# EAGLE design transponder-6.1.0 (EAGLE 9.6.1)

## Sheet 1 of 7
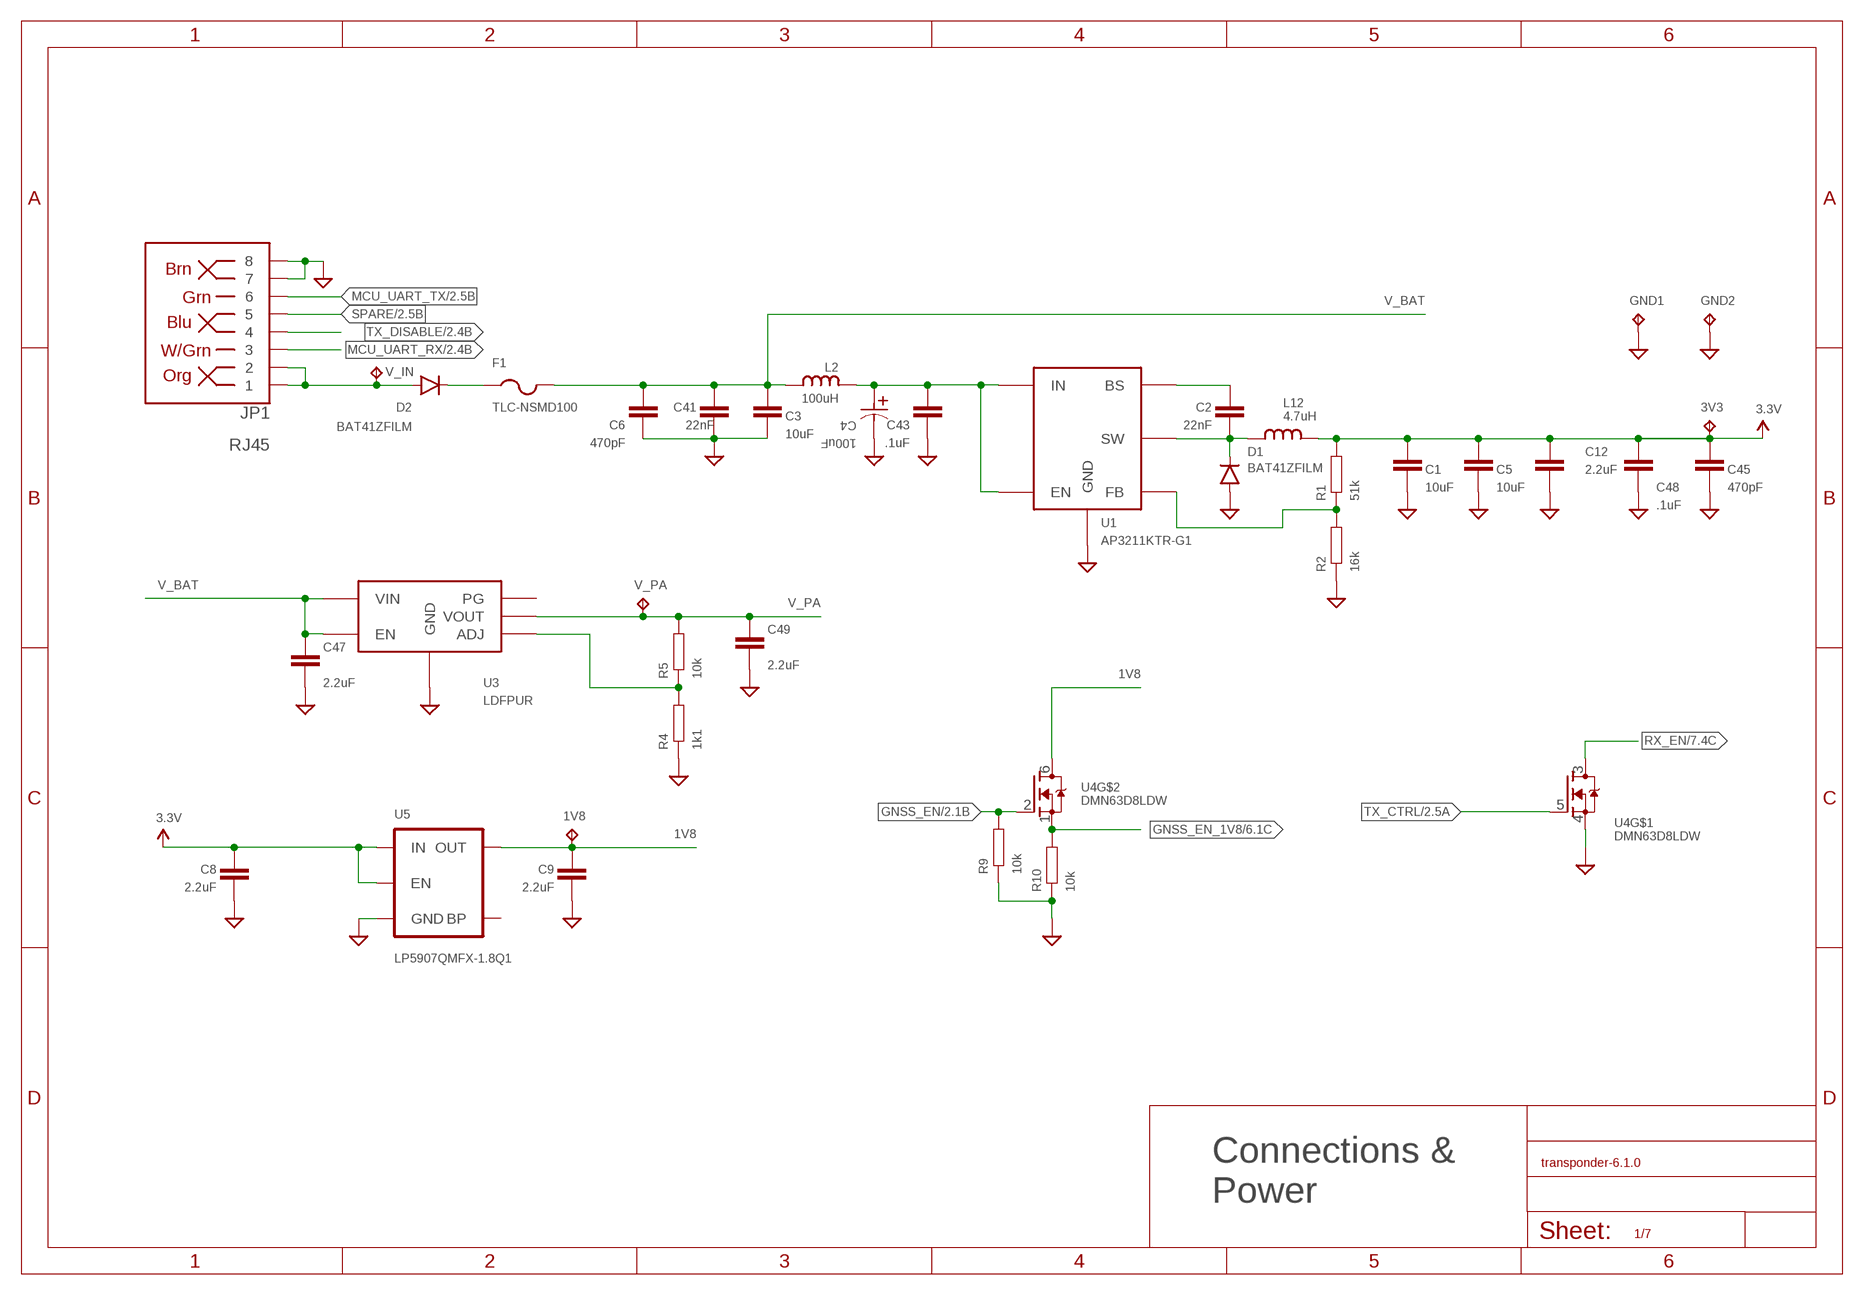
[diagram p0: schematic, sheet 1]

### Parts
1V8  TPTP12R  [TP12R]
3V3  TPTP16R  [TP16R]
C1  10uF  CAP0805  [0805]
C2  22nF  CAP0603-CAP  [0603-CAP]
C3  10uF  CAP0805  [0805]
C4  100uF  UWX1C101MCL1GB  [PCAP_6.3X5.4-ELECT]
C5  10uF  CAP0805  [0805]
C6  470pF  CAP0603-CAP  [0603-CAP]
C8  2.2uF  CAP0603-CAP  [0603-CAP]
C9  2.2uF  CAP0603-CAP  [0603-CAP]
C12  2.2uF  CAP0603-CAP  [0603-CAP]
C41  22nF  CAP0603-CAP  [0603-CAP]
C43  .1uF  CAP0603-CAP  [0603-CAP]
C45  470pF  CAP0603-CAP  [0603-CAP]
C47  2.2uF  CAP0603-CAP  [0603-CAP]
C48  .1uF  CAP0603-CAP  [0603-CAP]
C49  2.2uF  CAP0603-CAP  [0603-CAP]
D1  BAT41ZFILM  DIODESOD123  [SOD-123]
D2  BAT41ZFILM  DIODESOD123  [SOD-123]
F1  TLC-NSMD100  PTCFUSE-1206  [R1206]
GND1  TPTP16R  [TP16R]
GND2  TPTP16R  [TP16R]
JP1  RJ45  RJ45-8PTH  [RJ45-8]
L2  100uH  INDUCTOR1206  [1206]
L12  4.7uH  INDUCTOR0805  [0805]
R1  51k  RESISTOR0603-RES  [0603-RES]
R2  16k  RESISTOR0603-RES  [0603-RES]
R4  1k1  RESISTOR0603-RES  [0603-RES]
R5  10k  RESISTOR0603-RES  [0603-RES]
R9  10k  RESISTOR0603-RES  [0603-RES]
R10  10k  RESISTOR0603-RES  [0603-RES]
U1  AP3211KTR-G1  AP3211  [SOT23-6]
U3  LDFPUR  LDF  [DFN-6]
U4  DMN63D8LDW  [SOT363]
U5  LP5907QMFX-1.8Q1  V_REG_LDOSMD  [SOT23-5]
V_IN  TPTP12R  [TP12R]
V_PA  TPTP12R  [TP12R]

### Nets
1V8: 1V8.TP C9.1 U4.6(D) U5.5(OUT) ; also sheet 6,7
3.3V: 3V3.TP C1.1 C5.1 C8.1 C12.1 C45.1 C48.1 L12.P$2 R1.2 U5.1(IN) U5.3(EN) ; also sheet 2,4,6,7
GND: C1.2 C3.2 C4.2 C5.2 C6.2 C8.2 C9.2 C12.2 C41.2 C43.2 C45.2 C47.2 C48.2 C49.2 D1.A GND1.TP GND2.TP JP1.7 JP1.8 R2.1 R4.1 R9.1 R10.1 U1.2(GND) U3.P$4(GND) U3.P$7(GND) U4.4(S) U5.2(GND) ; also sheet 2,3,4,5,6,7
GNSS_EN: R9.2 U4.2(G) ; also sheet 2
GNSS_EN_1V8: R10.2 U4.1(S) ; also sheet 6
MCU_UART_RX: JP1.3 ; also sheet 2
MCU_UART_TX: JP1.6 ; also sheet 2
N$2: C2.2 D1.C L12.P$1 U1.6(SW)
N$4: C2.1 U1.1(BS)
N$5: R1.1 R2.2 U1.3(FB)
N$22: D2.C F1.1
N$27: C4.1 C43.1 L2.P$1 U1.4(EN) U1.5(IN)
N$32: R4.2 R5.1 U3.P$2(ADJ)
RX_EN: U4.3(D) ; also sheet 7
SPARE: JP1.5 ; also sheet 2
TX_CTRL: U4.5(G) ; also sheet 2,5
TX_DISABLE: JP1.4 ; also sheet 2
V_BAT: C3.1 C6.1 C41.1 C47.1 F1.2 L2.P$2 U3.P$5(EN) U3.P$6(VIN)
V_IN: D2.A JP1.1 JP1.2 V_IN.TP
V_PA: C49.1 R5.2 U3.P$1(VOUT) V_PA.TP ; also sheet 5
Unconnected: U3.P$3(PG) U5.4(BP)

### Notes on the sheet
- Connections &
  Power

## Sheet 2 of 7
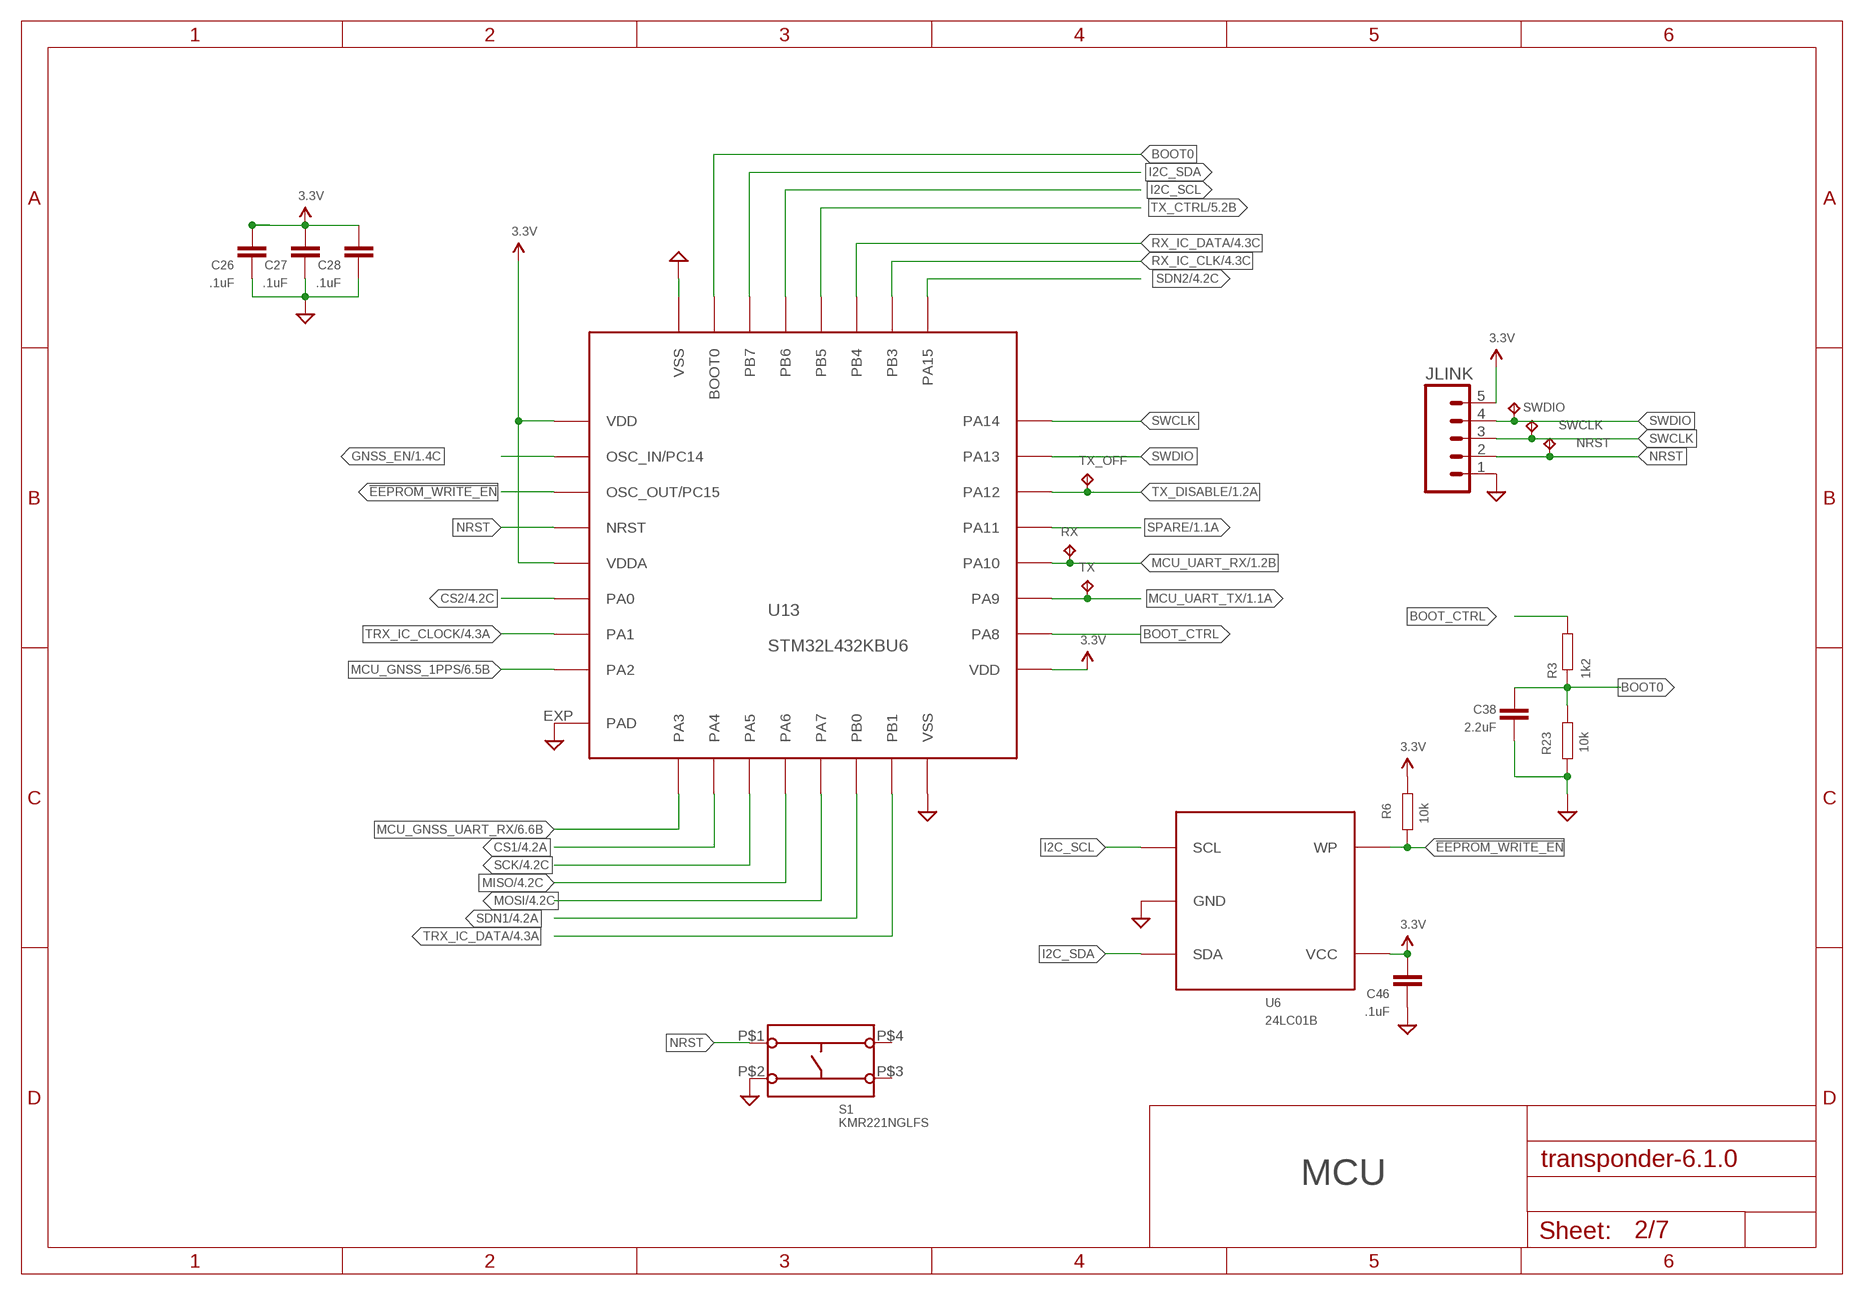
[diagram p1: schematic, sheet 2]

### Parts
C26  .1uF  CAP0603-CAP  [0603-CAP]
C27  .1uF  CAP0603-CAP  [0603-CAP]
C28  .1uF  CAP0603-CAP  [0603-CAP]
C38  2.2uF  CAP0603-CAP  [0603-CAP]
C46  .1uF  CAP0603-CAP  [0603-CAP]
JLINK  M05PTH  [1X05]
NRST  TPTP12R  [TP12R]
R3  1k2  RESISTOR0603-RES  [0603-RES]
R6  10k  RESISTOR0603-RES  [0603-RES]
R23  10k  RESISTOR0603-RES  [0603-RES]
RX  TPTP12R  [TP12R]
S1  KMR221NGLFS  [KMR221NGLFS]
SWCLK  TPTP12R  [TP12R]
SWDIO  TPTP12R  [TP12R]
TX  TPTP12R  [TP12R]
TX_OFF  TPTP12R  [TP12R]
U6  24LC01B  [SOT23-5]
U13  STM32L432KBU6  STM32L432KXXX  [QFN32]

### Nets
3.3V: C26.1 C27.1 C28.1 C46.1 JLINK.5 R6.1 U6.4(VCC) U13.1(VDD) U13.5(VDDA) U13.17(VDD) ; also sheet 1,4,6,7
!EEPROM_WRITE_EN: R6.2 U6.5(WP) U13.3(OSC_OUT/PC15)
BOOT0: C38.1 R3.1 R23.1 U13.31(BOOT0)
BOOT_CTRL: R3.2 U13.18(PA8)
CS1: U13.10(PA4) ; also sheet 4
CS2: U13.6(PA0) ; also sheet 4
GND: C26.2 C27.2 C28.2 C38.2 C46.2 JLINK.1 R23.2 S1.P$2(S2) U6.2(GND) U13.16(VSS) U13.32(VSS) U13.EXP(PAD) ; also sheet 1,3,4,5,6,7
GNSS_EN: U13.2(OSC_IN/PC14) ; also sheet 1
I2C_SCL: U6.1(SCL) U13.29(PB6)
I2C_SDA: U6.3(SDA) U13.30(PB7)
MCU_GNSS_1PPS: U13.8(PA2) ; also sheet 6
MCU_GNSS_UART_RX: U13.9(PA3) ; also sheet 6
MCU_UART_RX: RX.TP U13.20(PA10) ; also sheet 1
MCU_UART_TX: TX.TP U13.19(PA9) ; also sheet 1
MISO: U13.12(PA6) ; also sheet 4
MOSI: U13.13(PA7) ; also sheet 4
NRST: JLINK.2 NRST.TP S1.P$1(S1) U13.4(NRST)
RX_IC_CLK: U13.26(PB3) ; also sheet 4
RX_IC_DATA: U13.27(PB4) ; also sheet 4
SCK: U13.11(PA5) ; also sheet 4
SDN1: U13.14(PB0) ; also sheet 4
SDN2: U13.25(PA15) ; also sheet 4
SPARE: U13.21(PA11) ; also sheet 1
SWCLK: JLINK.3 SWCLK.TP U13.24(PA14)
SWDIO: JLINK.4 SWDIO.TP U13.23(PA13)
TRX_IC_CLOCK: U13.7(PA1) ; also sheet 4
TRX_IC_DATA: U13.15(PB1) ; also sheet 4
TX_CTRL: U13.28(PB5) ; also sheet 1,5
TX_DISABLE: TX_OFF.TP U13.22(PA12) ; also sheet 1
Unconnected: S1.P$3(S2) S1.P$4(S1)

### Notes on the sheet
- MCU

## Sheet 3 of 7
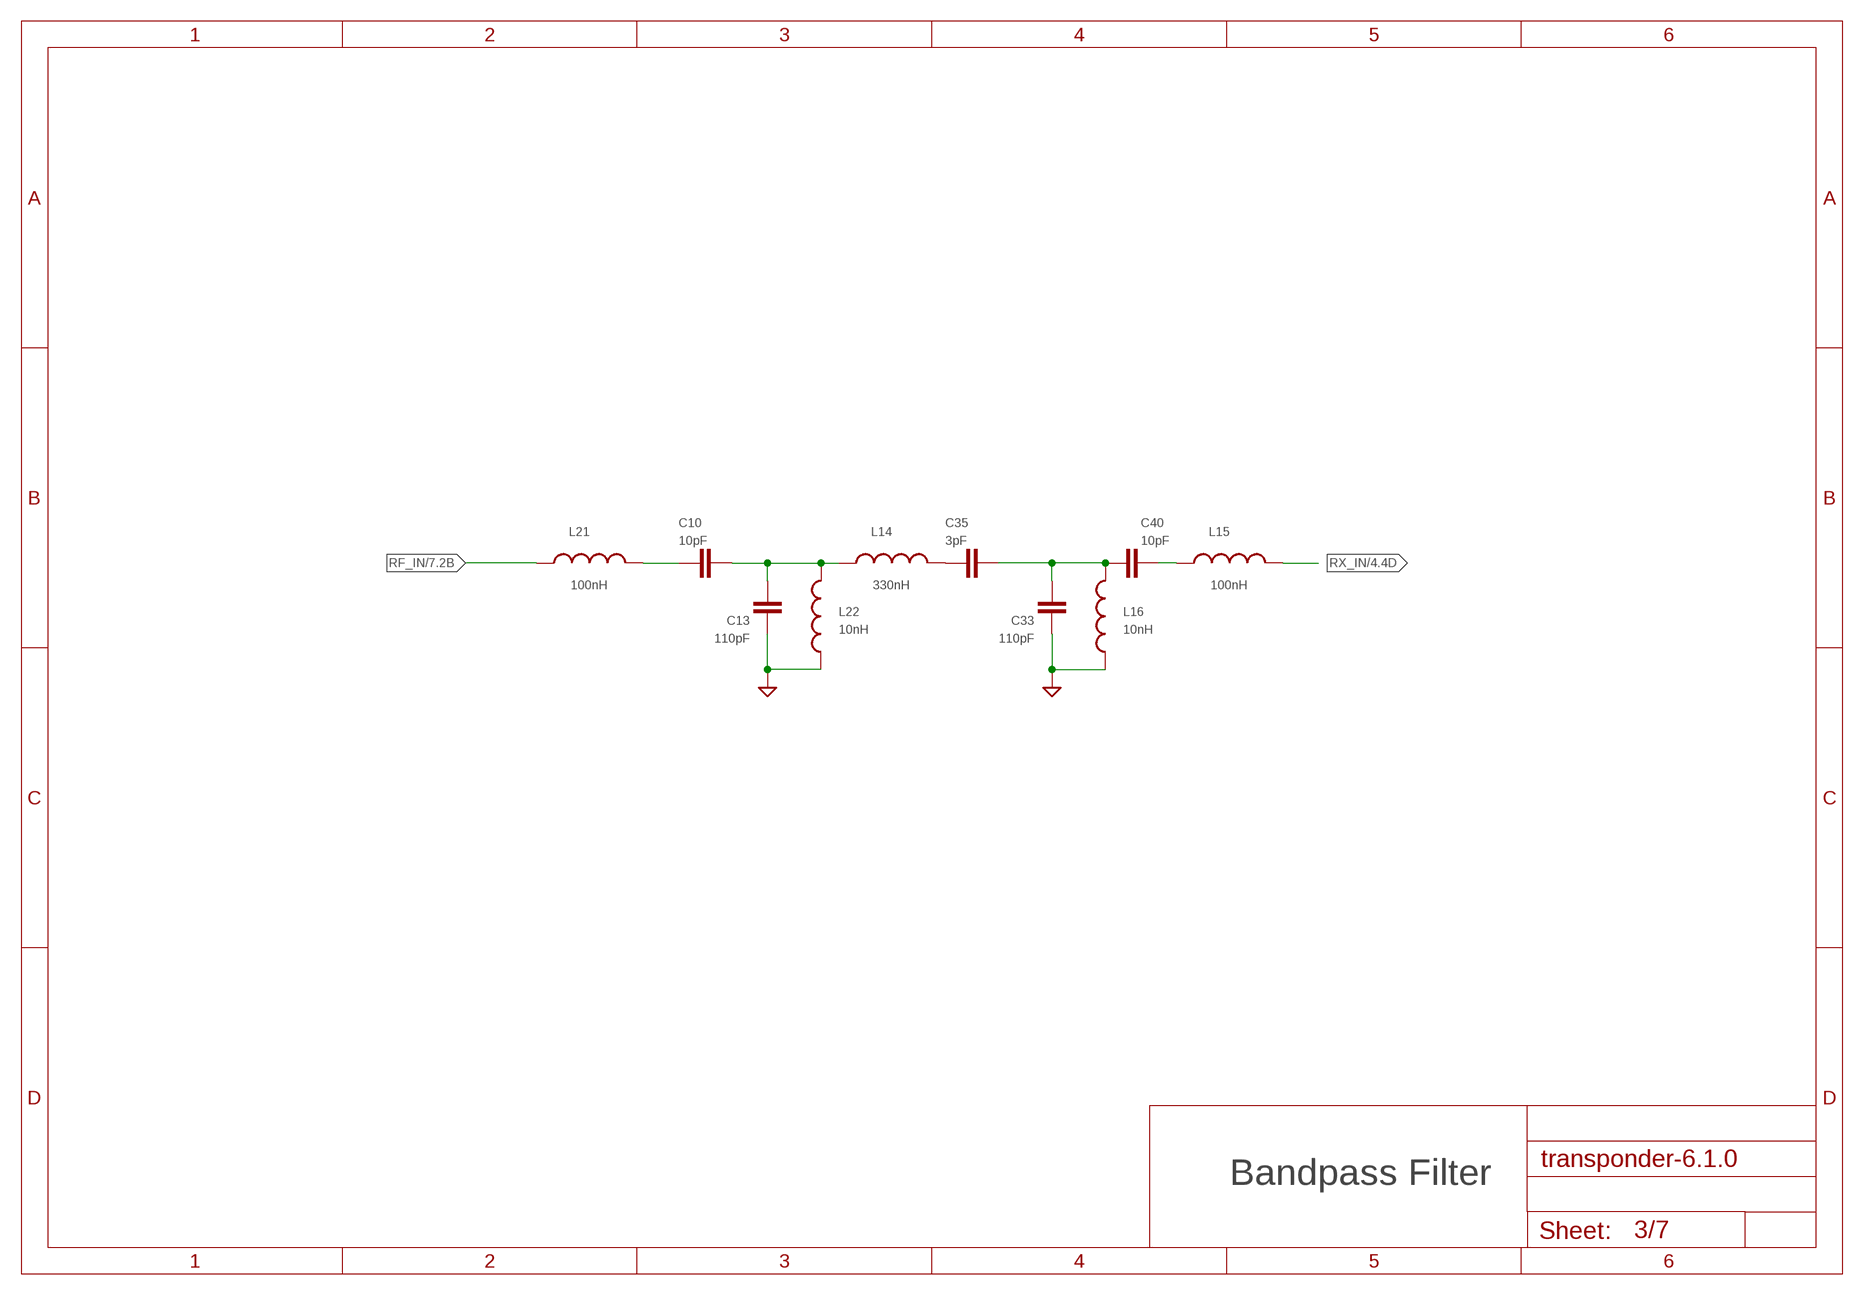
[diagram p2: schematic, sheet 3]

### Parts
C10  10pF  CAP0603-CAP  [0603-CAP]
C13  110pF  CAP0603-CAP  [0603-CAP]
C33  110pF  CAP0603-CAP  [0603-CAP]
C35  3pF  CAP0603-CAP  [0603-CAP]
C40  10pF  CAP0603-CAP  [0603-CAP]
L14  330nH  INDUCTOR0603  [0603]
L15  100nH  INDUCTOR0603  [0603]
L16  10nH  INDUCTOR0603  [0603]
L21  100nH  INDUCTOR0603  [0603]
L22  10nH  INDUCTOR0603  [0603]

### Nets
GND: C13.1 C33.1 L16.1 L22.1 ; also sheet 1,2,4,5,6,7
N$9: C10.2 L21.2
N$36: C10.1 C13.2 L14.1 L22.2
N$37: C33.2 C35.1 C40.2 L16.2
N$38: C40.1 L15.1
N$39: C35.2 L14.2
RF_IN: L21.1 ; also sheet 7
RX_IN: L15.2 ; also sheet 4

### Notes on the sheet
- Bandpass Filter

## Sheet 4 of 7
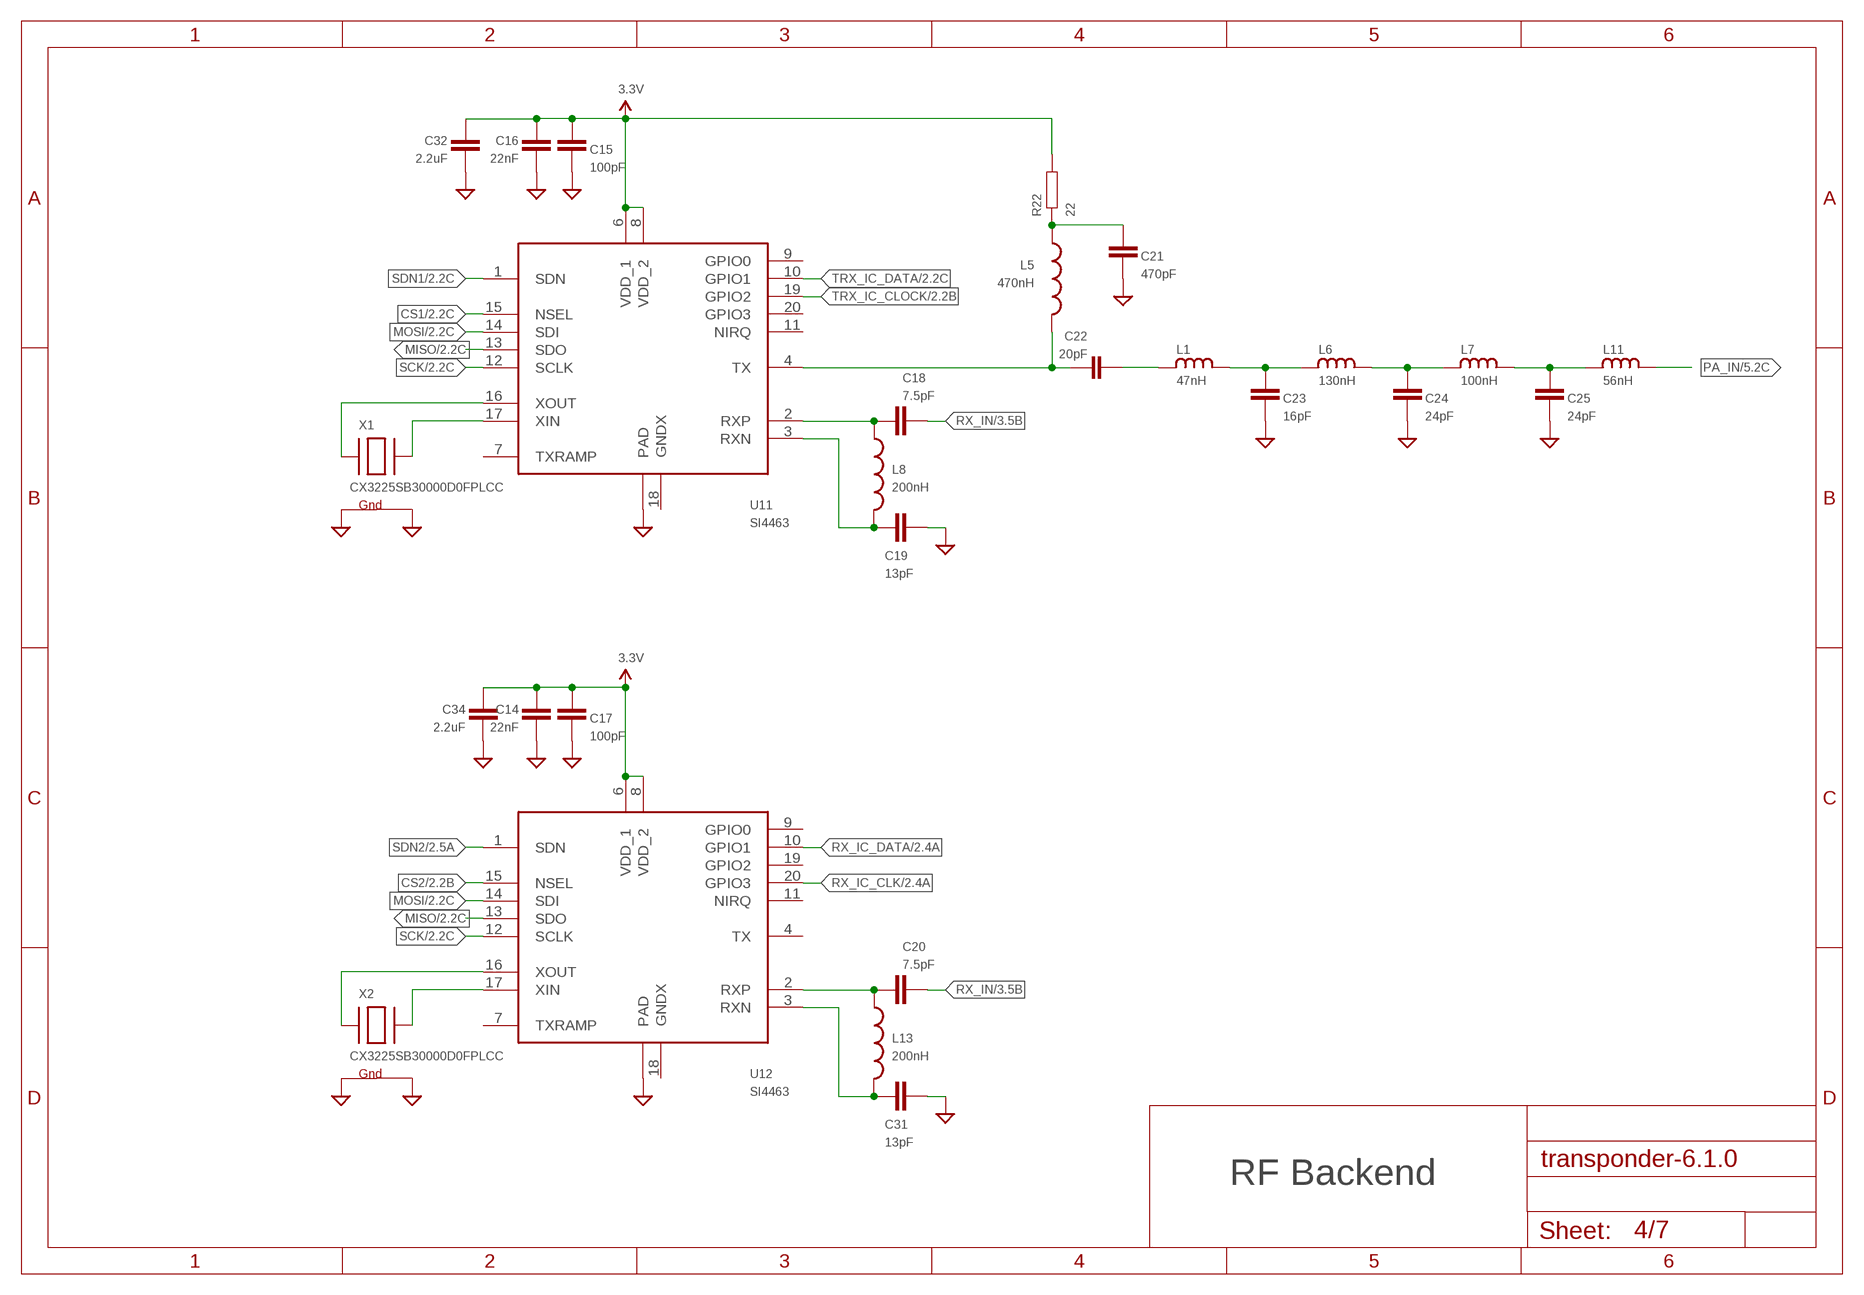
[diagram p3: schematic, sheet 4]

### Parts
C14  22nF  CAP0603-CAP  [0603-CAP]
C15  100pF  CAP0603-CAP  [0603-CAP]
C16  22nF  CAP0603-CAP  [0603-CAP]
C17  100pF  CAP0603-CAP  [0603-CAP]
C18  7.5pF  CAP0603-CAP  [0603-CAP]
C19  13pF  CAP0603-CAP  [0603-CAP]
C20  7.5pF  CAP0603-CAP  [0603-CAP]
C21  470pF  CAP0603-CAP  [0603-CAP]
C22  20pF  CAPACITOR0603  [0603]
C23  16pF  CAP0603-CAP  [0603-CAP]
C24  24pF  CAP0603-CAP  [0603-CAP]
C25  24pF  CAP0603-CAP  [0603-CAP]
C31  13pF  CAP0603-CAP  [0603-CAP]
C32  2.2uF  CAP0603-CAP  [0603-CAP]
C34  2.2uF  CAP0603-CAP  [0603-CAP]
L1  47nH  INDUCTOR0603  [0603]
L5  470nH  INDUCTOR0603  [0603]
L6  130nH  INDUCTOR0603  [0603]
L7  100nH  INDUCTOR0603  [0603]
L8  200nH  INDUCTOR0603  [0603]
L11  56nH  INDUCTOR0603  [0603]
L13  200nH  INDUCTOR0603  [0603]
R22  22  RESISTOR0603-RES  [0603-RES]
U11  SI4463  [SI4463]
U12  SI4463  [SI4463]
X1  CX3225SB30000D0FPLCC  XTAL-4-3225  [NX3225]
X2  CX3225SB30000D0FPLCC  XTAL-4-3225  [NX3225]

### Nets
3.3V: C14.1 C15.1 C16.1 C17.1 C32.1 C34.1 R22.2 U11.6(VDD_1) U11.8(VDD_2) U12.6(VDD_1) U12.8(VDD_2) ; also sheet 1,2,6,7
CS1: U11.15(NSEL) ; also sheet 2
CS2: U12.15(NSEL) ; also sheet 2
GND: C14.2 C15.2 C16.2 C17.2 C19.1 C21.2 C23.2 C24.2 C25.2 C31.1 C32.2 C34.2 U11.EXP(PAD) U12.EXP(PAD) X1.2(G2) X1.4(G1) X2.2(G2) X2.4(G1) ; also sheet 1,2,3,5,6,7
MISO: U11.13(SDO) U12.13(SDO) ; also sheet 2
MOSI: U11.14(SDI) U12.14(SDI) ; also sheet 2
N$3: C19.2 L8.2 U11.3(RXN)
N$6: C18.1 L8.1 U11.2(RXP)
N$7: C24.1 L6.P$2 L7.P$1
N$11: C25.1 L7.P$2 L11.P$1
N$12: C23.1 L1.P$2 L6.P$1
N$16: U12.16(XOUT) X2.1(X1)
N$17: U12.17(XIN) X2.3(X2)
N$18: U11.16(XOUT) X1.1(X1)
N$19: U11.17(XIN) X1.3(X2)
N$20: C20.1 L13.1 U12.2(RXP)
N$21: C31.2 L13.2 U12.3(RXN)
N$24: C22.P$1 L5.2 U11.4(TX)
N$30: C21.1 L5.1 R22.1
N$31: C22.P$2 L1.P$1
PA_IN: L11.P$2 ; also sheet 5
RX_IC_CLK: U12.20(GPIO3) ; also sheet 2
RX_IC_DATA: U12.10(GPIO1) ; also sheet 2
RX_IN: C18.2 C20.2 ; also sheet 3
SCK: U11.12(SCLK) U12.12(SCLK) ; also sheet 2
SDN1: U11.1(SDN) ; also sheet 2
SDN2: U12.1(SDN) ; also sheet 2
TRX_IC_CLOCK: U11.19(GPIO2) ; also sheet 2
TRX_IC_DATA: U11.10(GPIO1) ; also sheet 2
Unconnected: U11.7(TXRAMP) U11.9(GPIO0) U11.11(NIRQ) U11.18(GNDX) U11.20(GPIO3) U12.4(TX) U12.7(TXRAMP) U12.9(GPIO0) U12.11(NIRQ) U12.18(GNDX) U12.19(GPIO2)

### Notes on the sheet
- RF Backend

## Sheet 5 of 7
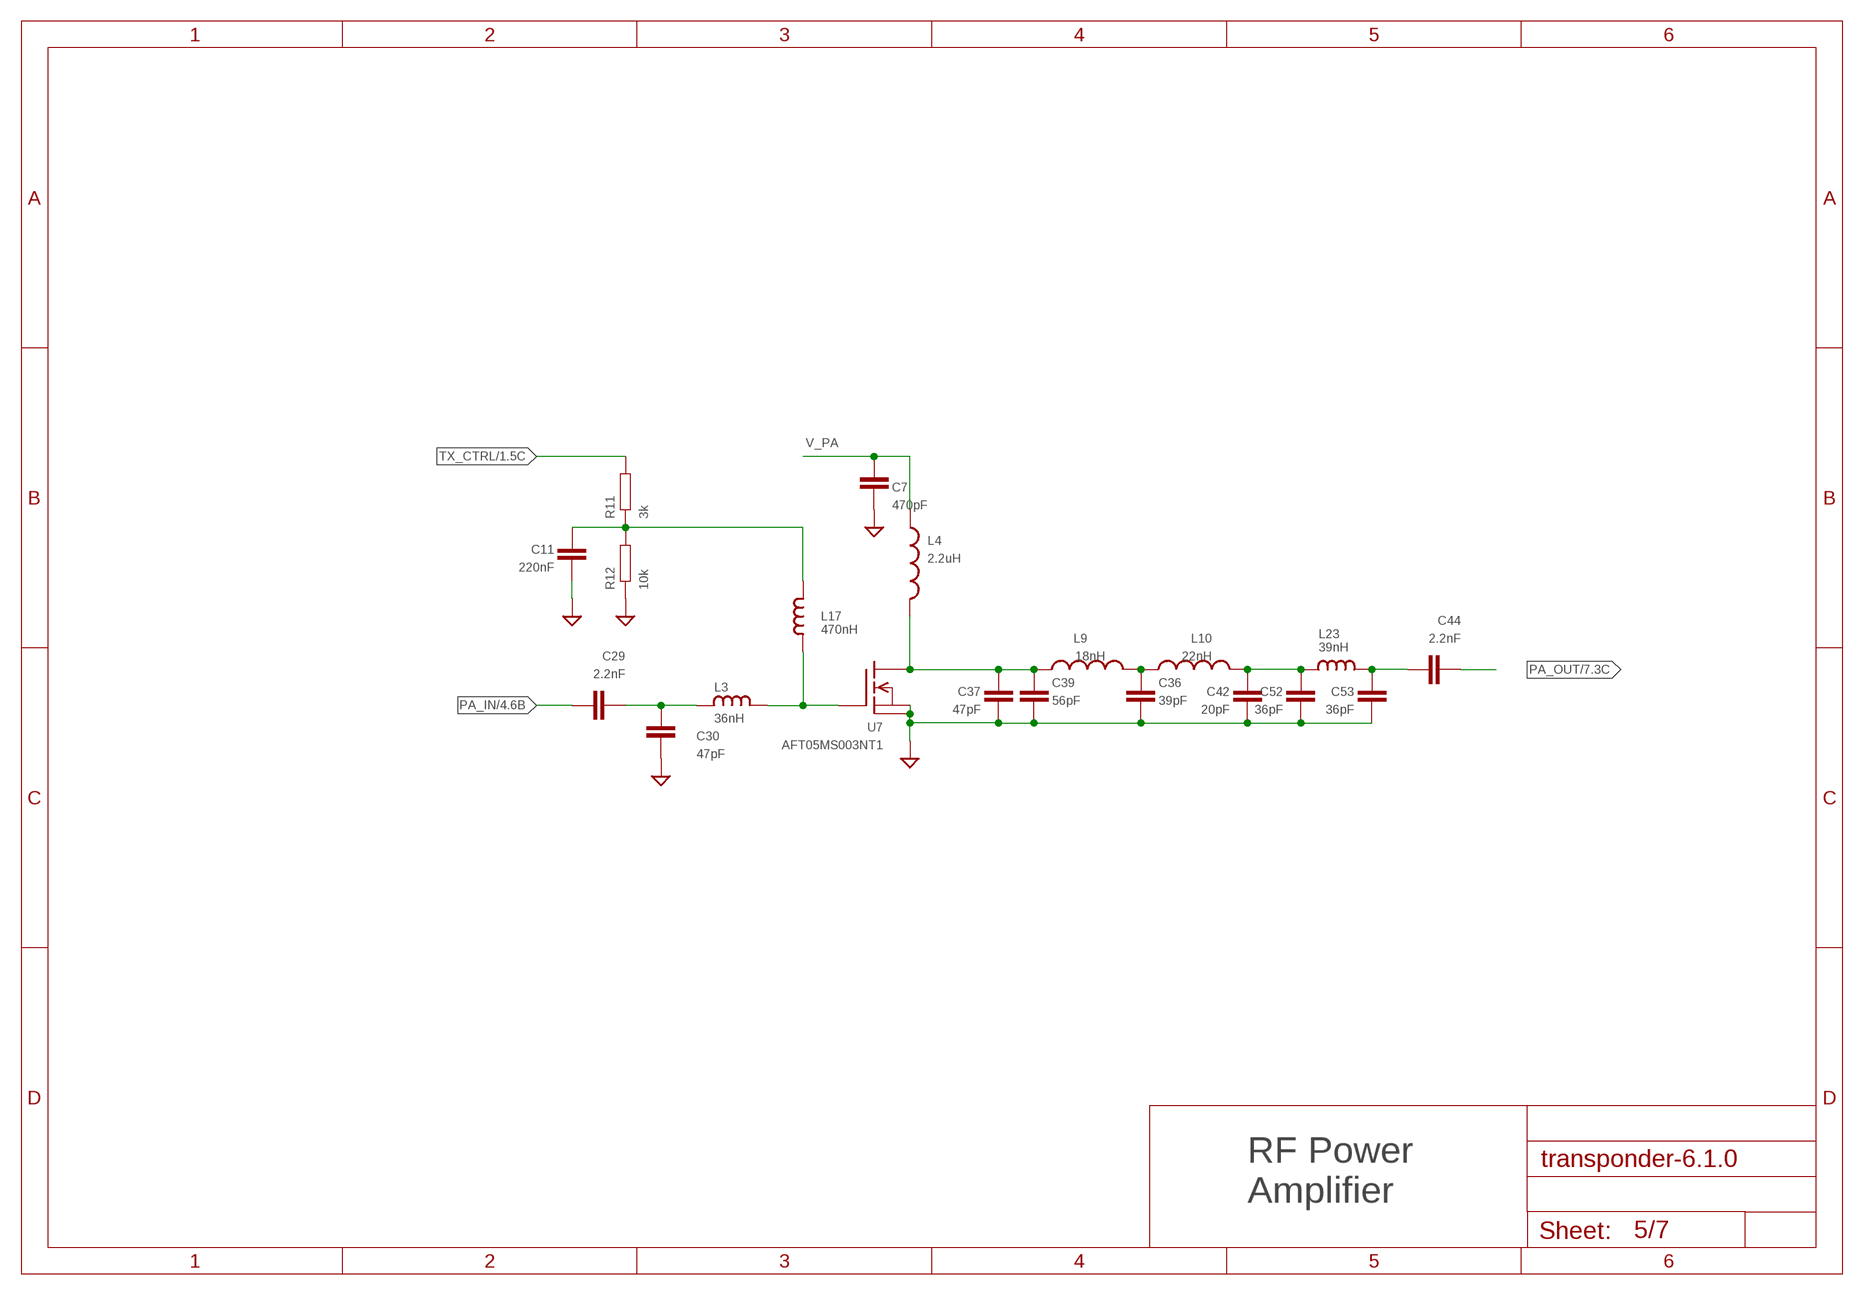
[diagram p4: schematic, sheet 5]

### Parts
C7  470pF  CAP0603-CAP  [0603-CAP]
C11  220nF  CAP0603-CAP  [0603-CAP]
C29  2.2nF  CAP0603-CAP  [0603-CAP]
C30  47pF  CAP0603-CAP  [0603-CAP]
C36  39pF  CAP0603-CAP  [0603-CAP]
C37  47pF  CAP0603-CAP  [0603-CAP]
C39  56pF  CAP0603-CAP  [0603-CAP]
C42  20pF  CAP0603-CAP  [0603-CAP]
C44  2.2nF  CAP0603-CAP  [0603-CAP]
C52  36pF  CAP0603-CAP  [0603-CAP]
C53  36pF  CAP0603-CAP  [0603-CAP]
L3  36nH  INDUCTOR0603  [0603]
L4  2.2uH  INDUCTOR0805  [0805]
L9  18nH  INDUCTOR0603  [0603]
L10  22nH  INDUCTOR0603  [0603]
L17  470nH  INDUCTOR0603  [0603]
L23  39nH  INDUCTOR0603  [0603]
R11  3k  RESISTOR0603-RES  [0603-RES]
R12  10k  RESISTOR0603-RES  [0603-RES]
U7  AFT05MS003NT1  AFT0SMS003N  [SOT-89]

### Nets
GND: C7.2 C11.2 C30.2 C36.2 C37.2 C39.2 C42.2 C52.2 C53.2 R12.1 U7.2(S) U7.2@1(PAD) ; also sheet 1,2,3,4,6,7
N$8: C11.1 L17.P$2 R11.1 R12.2
N$23: C37.1 C39.1 L4.2 L9.1 U7.3(D)
N$26: L3.P$2 L17.P$1 U7.1(G)
N$28: C36.1 L9.2 L10.1
N$29: C29.2 C30.1 L3.P$1
N$40: C42.1 C52.1 L10.2 L23.P$1
N$41: C44.1 C53.1 L23.P$2
PA_IN: C29.1 ; also sheet 4
PA_OUT: C44.2 ; also sheet 7
TX_CTRL: R11.2 ; also sheet 1,2
V_PA: C7.1 L4.1 ; also sheet 1

### Notes on the sheet
- RF Power
  Amplifier

## Sheet 6 of 7
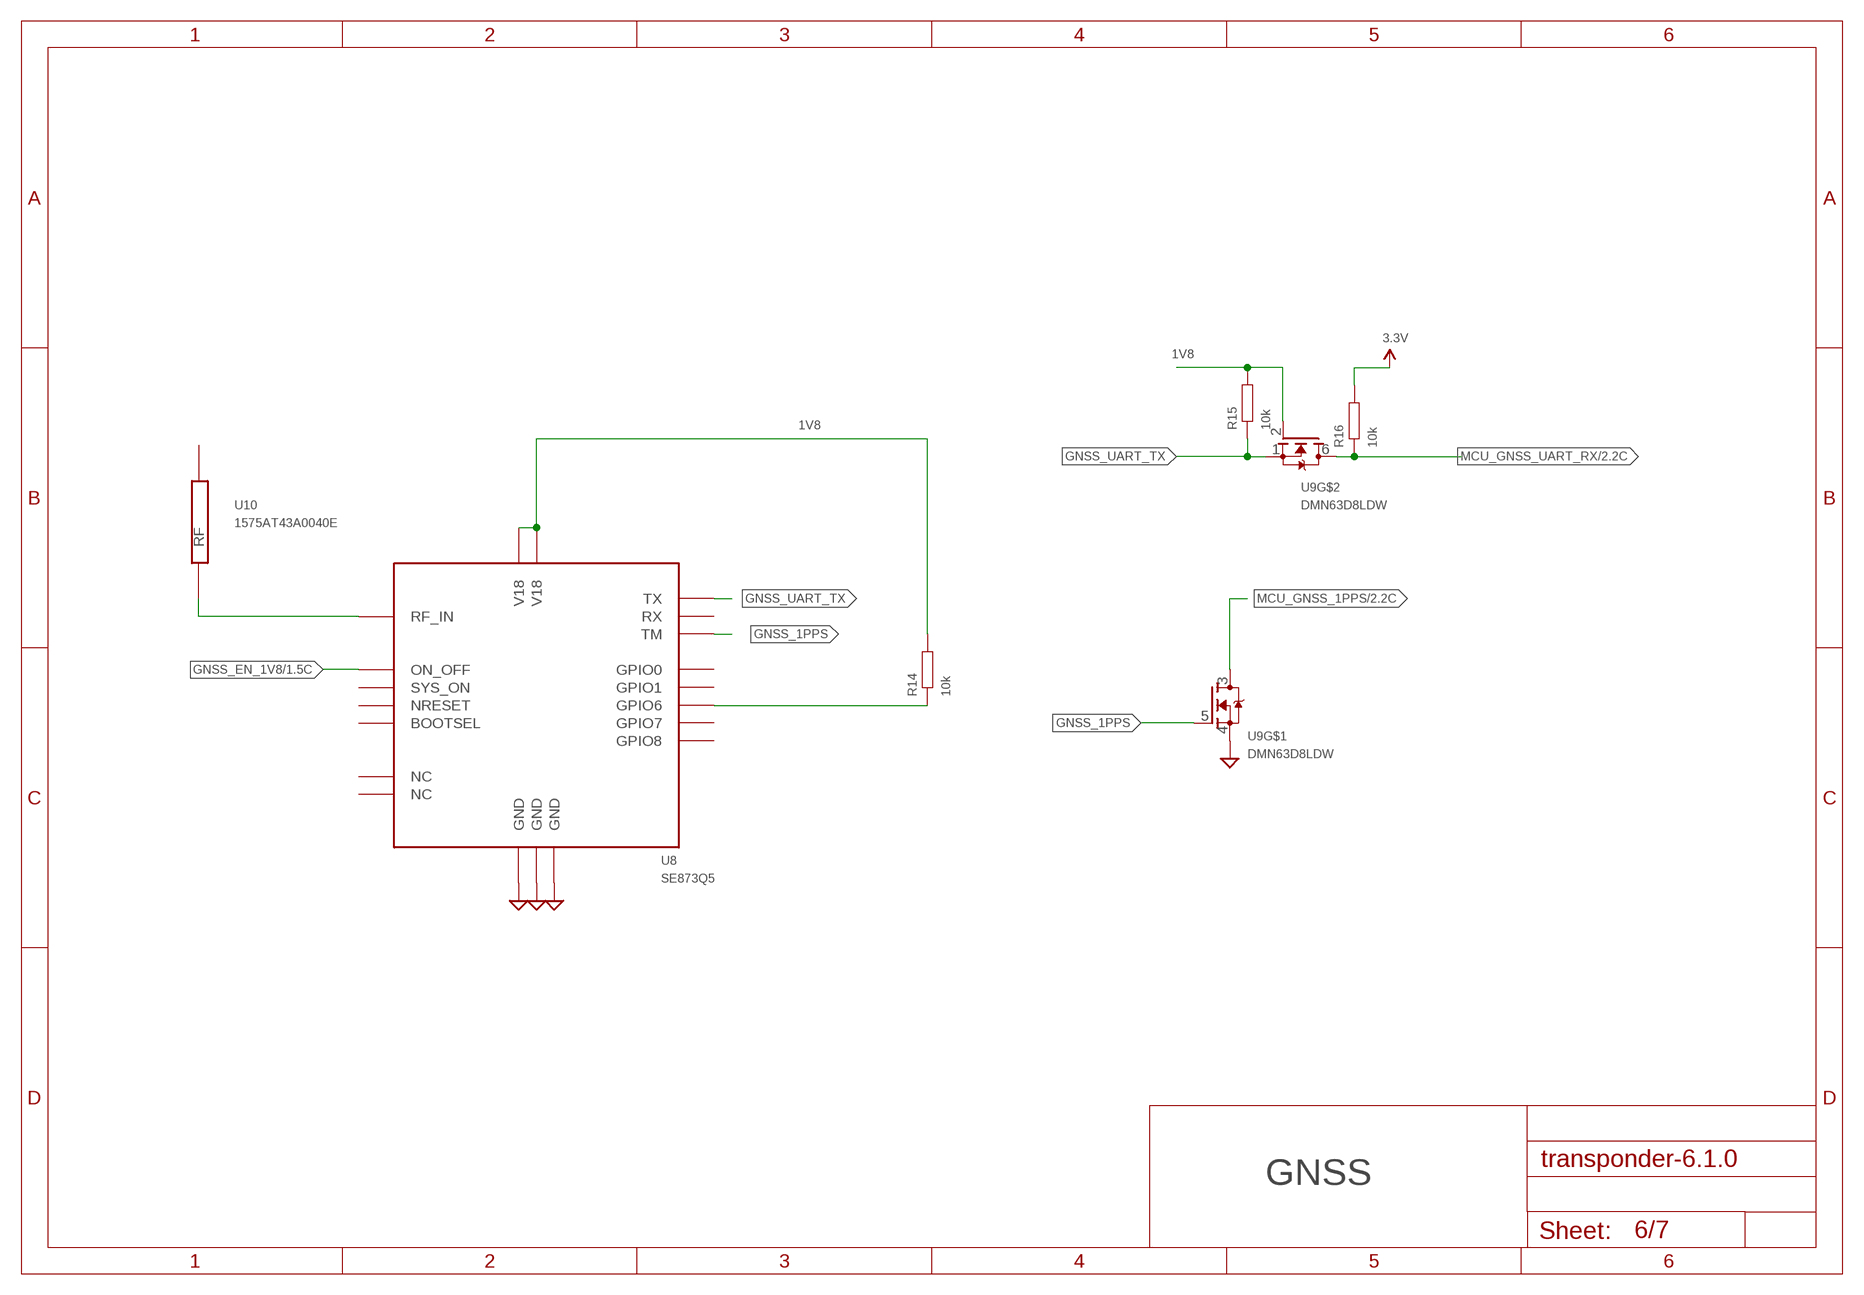
[diagram p5: schematic, sheet 6]

### Parts
R14  10k  RESISTOR0603-RES  [0603-RES]
R15  10k  RESISTOR0603-RES  [0603-RES]
R16  10k  RESISTOR0603-RES  [0603-RES]
U8  SE873Q5  SE873  [SE873]
U9  DMN63D8LDW  [SOT363]
U10  1575AT43A0040E  [1575AT43A0040E]

### Nets
1V8: R14.2 R15.2 U8.P$3(V18) U8.P$19(V18) U9.2(G) ; also sheet 1,7
3.3V: R16.2 ; also sheet 1,2,4,7
GND: U8.P$2(GND) U8.P$10(GND) U8.P$20(GND) U9.4(S) ; also sheet 1,2,3,4,5,7
GNSS_1PPS: U8.P$11(TM) U9.5(G)
GNSS_EN_1V8: U8.P$6(ON_OFF) ; also sheet 1
GNSS_UART_TX: R15.1 U8.P$15(TX) U9.1(S)
MCU_GNSS_1PPS: U9.3(D) ; also sheet 2
MCU_GNSS_UART_RX: R16.1 U9.6(D) ; also sheet 2
N$10: U8.P$1(RF_IN) U10.P$1(RF)
N$13: R14.1 U8.P$13(GPIO6)
Unconnected: U8.P$4(NC) U8.P$5(GPIO8) U8.P$7(SYS_ON) U8.P$8(NRESET) U8.P$9(BOOTSEL) U8.P$12(GPIO7) U8.P$14(RX) U8.P$16(NC) U8.P$17(GPIO1) U8.P$18(GPIO0) U10.P$2(PAD)

### Notes on the sheet
- GNSS

## Sheet 7 of 7
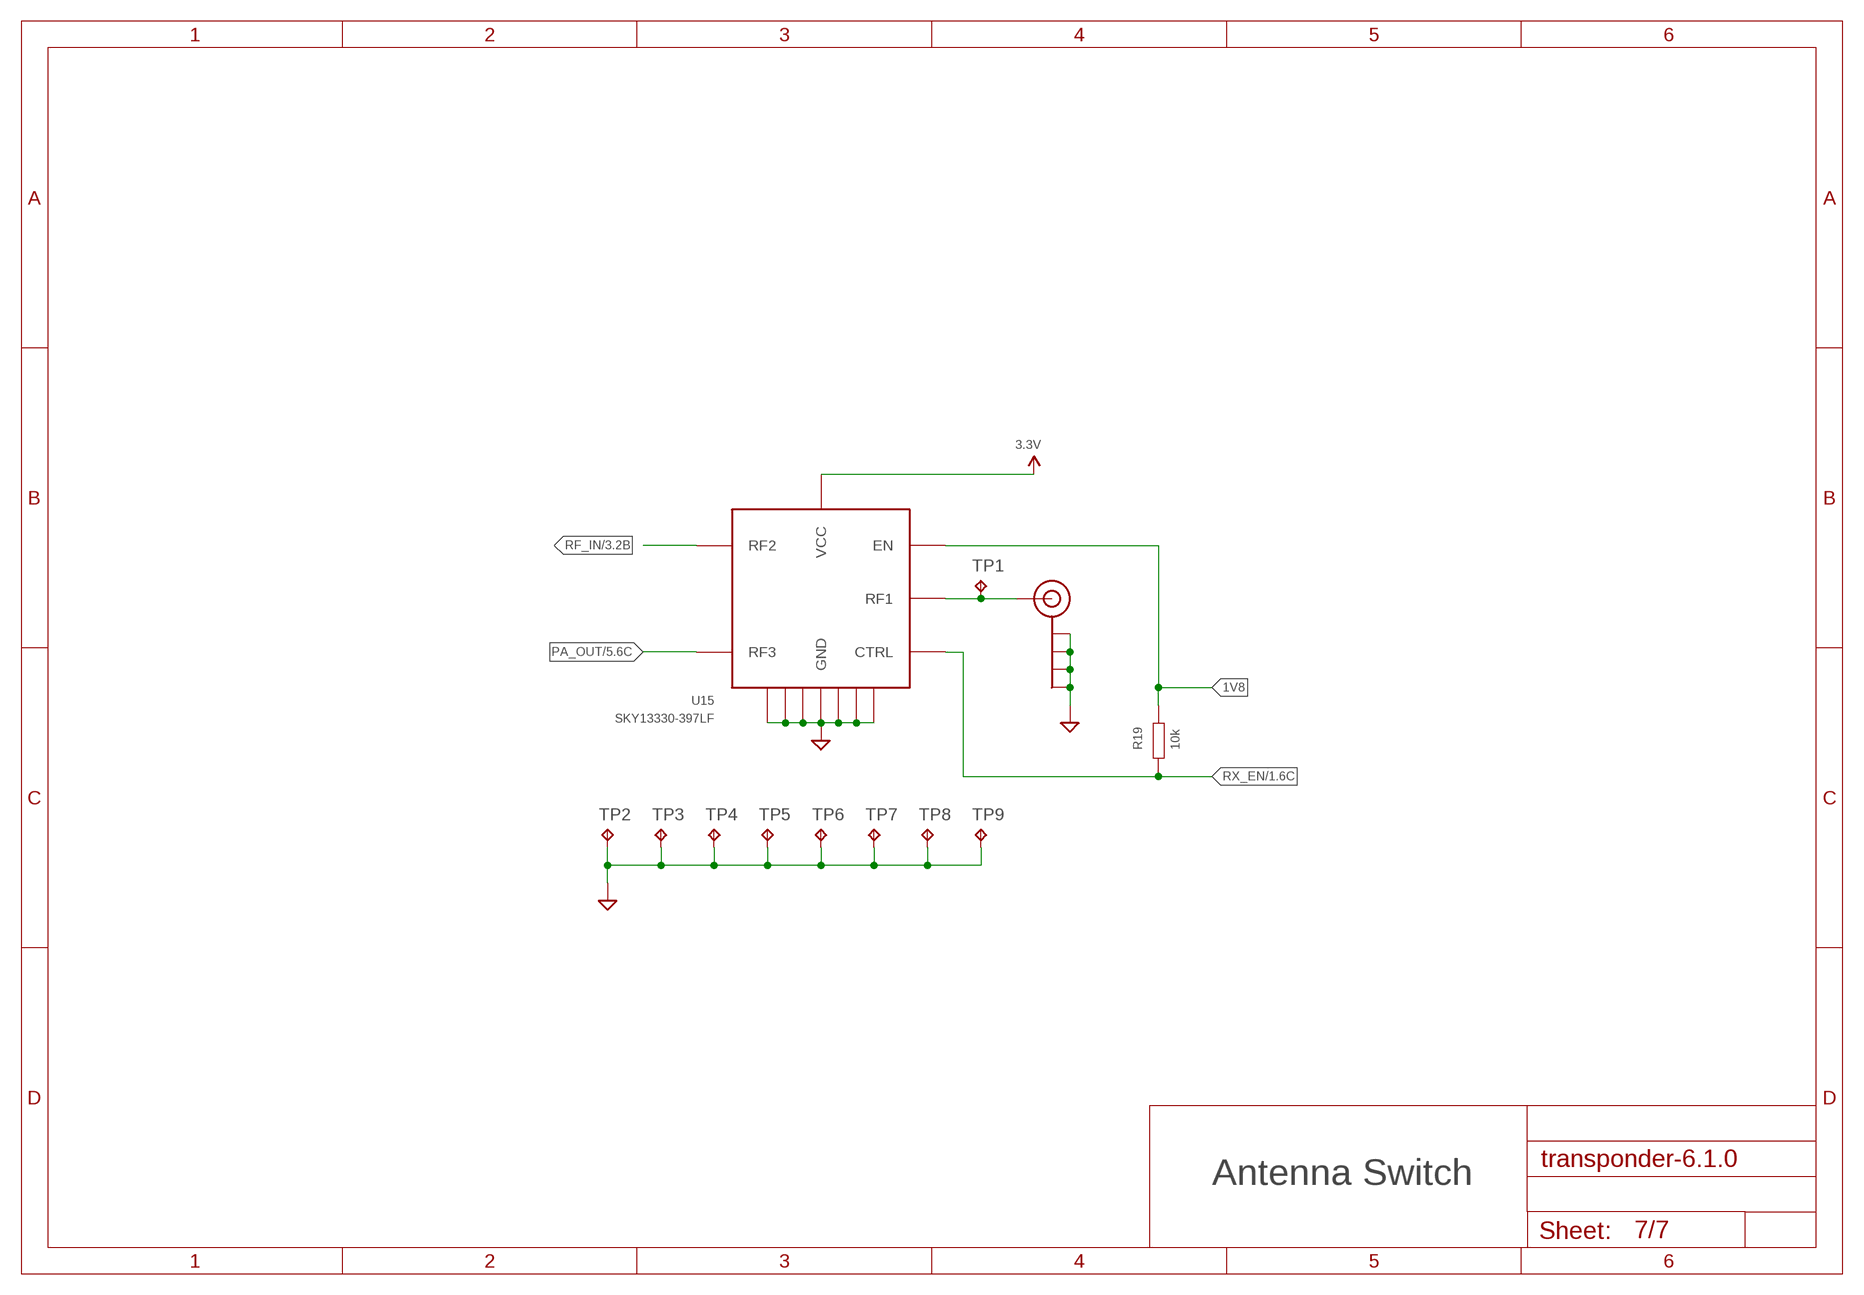
[diagram p6: schematic, sheet 7]

### Parts
J$1  SMA_EDGE  [SMA-EDGE]
R19  10k  RESISTOR0603-RES  [0603-RES]
TP1  TPTP10R  [TP10R]
TP2  TPTP08R  [TP08R]
TP3  TPTP08R  [TP08R]
TP4  TPTP08R  [TP08R]
TP5  TPTP08R  [TP08R]
TP6  TPTP08R  [TP08R]
TP7  TPTP08R  [TP08R]
TP8  TPTP08R  [TP08R]
TP9  TPTP08R  [TP08R]
U15  SKY13330-397LF  SKYWORKS-13330397LF  [QFN12]

### Nets
1V8: R19.2 U15.P$8(EN) ; also sheet 1,6
3.3V: U15.P$9(VCC) ; also sheet 1,2,4,6
GND: J$1.GND@0(GND) J$1.GND@1(GND) J$1.GND@2(GND) J$1.GND@3(GND) TP2.TP TP3.TP TP4.TP TP5.TP TP6.TP TP7.TP TP8.TP TP9.TP U15.P$1(GND) U15.P$3(GND) U15.P$4(GND) U15.P$6(GND) U15.P$10(GND) U15.P$12(GND) U15.P$13(GND) ; also sheet 1,2,3,4,5,6
N$15: J$1.SIG(SIGNAL) TP1.TP U15.P$2(RF1)
PA_OUT: U15.P$5(RF3) ; also sheet 5
RF_IN: U15.P$11(RF2) ; also sheet 3
RX_EN: R19.1 U15.P$7(CTRL) ; also sheet 1

### Notes on the sheet
- Antenna Switch

## Library data of the parts
1V8 3V3 GND1 GND2 NRST RX SWCLK SWDIO TX TX_OFF V_IN V_PA = testpad:TP: Test pad; DNP: T
C1 C3 C5 = SparkFun-Capacitors:CAP: Capacitor Standard 0603 ceramic capacitor, and 0.1" leaded capacitor.; PARTNO: EMK212ABJ106KG-T
C2 C14 C16 C41 = SparkFun-Capacitors:CAP: Capacitor Standard 0603 ceramic capacitor, and 0.1" leaded capacitor.; PARTNO: GRM188R71E223KA01D
C4 = UWX1C101MCL1GB:UWX1C101MCL1GB: 100µF 16V Aluminum Electrolytic Capacitors Radial, Can - SMD 2000 Hrs @ 85°C Check prices <https://snapeda.com/parts/UWX1C101MCL1GB/Nichicon/view-part/?ref=eda>; ARROW_ELECTRONICS-PURCHASE-URL: https://snapeda.com/shop?store=Arrow+Electronics&id=624199; AVAILABILITY: Good; DESCRIPTION: 100µF 16V Aluminum Electrolytic Capacitors Radial, Can - SMD 2000 Hrs @ 85°C; DIGIKEY-PURCHASE-URL: https://snapeda.com/shop?store=DigiKey&id=624199; MF: Nichicon; MOUSER-PURCHASE-URL: https://snapeda.com/shop?store=Mouser&id=624199; MP: UWX1C101MCL1GB; PACKAGE: Radial Nichicon; PARTNO: UWX1C101MCL1GB; PRICE: None
C6 C7 C21 C45 = SparkFun-Capacitors:CAP: Capacitor Standard 0603 ceramic capacitor, and 0.1" leaded capacitor.; PARTNO: GCM1885C2A471JA16J
C8 C9 C12 C32 C34 C38 C47 C49 = SparkFun-Capacitors:CAP: Capacitor Standard 0603 ceramic capacitor, and 0.1" leaded capacitor.; PARTNO: EMK107BJ225KA-T
C10 C11 C13 C33 C35 C40 C52 C53 = SparkFun-Capacitors:CAP: Capacitor Standard 0603 ceramic capacitor, and 0.1" leaded capacitor.
C15 C17 = SparkFun-Capacitors:CAP: Capacitor Standard 0603 ceramic capacitor, and 0.1" leaded capacitor.; PARTNO: GCM1885C2A101JA16D
C18 C20 = SparkFun-Capacitors:CAP: Capacitor Standard 0603 ceramic capacitor, and 0.1" leaded capacitor.; PARTNO: GRM1885C1H7R5DA01D
C19 C31 = SparkFun-Capacitors:CAP: Capacitor Standard 0603 ceramic capacitor, and 0.1" leaded capacitor.; PARTNO: GRM1885C1H130JA01D
C22 = MyPassives:CAPACITOR: Standard SMD capacitor; PARTNO: GRM1885C1H200JA01D
C23 = SparkFun-Capacitors:CAP: Capacitor Standard 0603 ceramic capacitor, and 0.1" leaded capacitor.; PARTNO: GCM1885C2A160JA16D
C24 C25 = SparkFun-Capacitors:CAP: Capacitor Standard 0603 ceramic capacitor, and 0.1" leaded capacitor.; PARTNO: GCM1885C2A240JA16D
C26-C28 C43 C46 C48 = SparkFun-Capacitors:CAP: Capacitor Standard 0603 ceramic capacitor, and 0.1" leaded capacitor.; PARTNO: EMK107B7104KAHT
C29 C44 = SparkFun-Capacitors:CAP: Capacitor Standard 0603 ceramic capacitor, and 0.1" leaded capacitor.; PARTNO: GRM1885C1H222JA01J
C30 C37 = SparkFun-Capacitors:CAP: Capacitor Standard 0603 ceramic capacitor, and 0.1" leaded capacitor.; PARTNO: Murata Electronics
C36 = SparkFun-Capacitors:CAP: Capacitor Standard 0603 ceramic capacitor, and 0.1" leaded capacitor.; PARTNO: GRM1885C1H390JA01D
C39 = SparkFun-Capacitors:CAP: Capacitor Standard 0603 ceramic capacitor, and 0.1" leaded capacitor.; PARTNO: GRM1885C1H560JA01D
C42 = SparkFun-Capacitors:CAP: Capacitor Standard 0603 ceramic capacitor, and 0.1" leaded capacitor.; PARTNO: GRM1885C1H200JA01D
D1 D2 = SparkFun-DiscreteSemi:DIODE: Diode These are standard reverse protection diodes and small signal diodes. SMA package can handle up to about 1A. SOD-323 can handle about 200mA. What the SOD-323 package when ordering, there are some mfgs out there that are 5-pin packages.; PARTNO: BAT41ZFILM
F1 = adafruit:PTCFUSE: PTC fuses, resettable thermistors; PARTNO: TLC-NSMD100
J$1 = SparkFun-Connectors:SMA_EDGE: SMA Antenna Connector End launch SMA connector. The paste layer has been removed so that the connector can be hand soldered onto the board after reflow.; DNP: T
JLINK = SparkFun-Connectors:M05: Header 5 Standard 5-pin 0.1" header. Use with straight break away headers (SKU : PRT-00116), right angle break away headers (PRT-00553), swiss pins (PRT-00743), machine pins (PRT-00117), and female headers (PRT-00115). Molex polarized connector foot print use with SKU : PRT-08230 with associated crimp pins and housings.; DNP: T
JP1 = SparkFun-Connectors:RJ45-8: RJ45 Jack Simple RJ45, 8-pin connection - connector for common Cat5, Cat5e, and Cat6 Ethernet cables. Footprint not yet proven in production. Connector sku is PRT-00643; Breakout PCB sku is BOB-00716.; PROD_ID: CONN-08506
L1 = MyPassives:INDUCTOR: Standard SMD inductor; PARTNO: LQW18AS47NG00D
L2 = MyPassives:INDUCTOR: Standard SMD inductor; PARTNO: CBC3225T101KRV
L3 L23 = MyPassives:INDUCTOR: Standard SMD inductor
L4 = SparkFun-Passives:INDUCTOR: Inductors Basic Inductor/Choke - 0603 and 1206. Footprints are not proven and vary greatly between part numbers. INDUCTOR POWER 3.3UH 4.0A SMD 0.197" L x 0.197" W x 0.177" H (5.00mm x 5.00mm x 4.50mm); PARTNO: BRC2012T2R2MD
L5 = SparkFun-Passives:INDUCTOR: Inductors Basic Inductor/Choke - 0603 and 1206. Footprints are not proven and vary greatly between part numbers. INDUCTOR POWER 3.3UH 4.0A SMD 0.197" L x 0.197" W x 0.177" H (5.00mm x 5.00mm x 4.50mm); PARTNO: HK1608R47J-T
L6 = MyPassives:INDUCTOR: Standard SMD inductor; PARTNO: LQW18ANR13G00D
L7 = MyPassives:INDUCTOR: Standard SMD inductor; PARTNO: LQW18ANR10G00D
L8 L13 = SparkFun-Passives:INDUCTOR: Inductors Basic Inductor/Choke - 0603 and 1206. Footprints are not proven and vary greatly between part numbers. INDUCTOR POWER 3.3UH 4.0A SMD 0.197" L x 0.197" W x 0.177" H (5.00mm x 5.00mm x 4.50mm); PARTNO: LQW18ANR20J00D
L9 = SparkFun-Passives:INDUCTOR: Inductors Basic Inductor/Choke - 0603 and 1206. Footprints are not proven and vary greatly between part numbers. INDUCTOR POWER 3.3UH 4.0A SMD 0.197" L x 0.197" W x 0.177" H (5.00mm x 5.00mm x 4.50mm); PARTNO: LQW18AN18NG00D
L10 = SparkFun-Passives:INDUCTOR: Inductors Basic Inductor/Choke - 0603 and 1206. Footprints are not proven and vary greatly between part numbers. INDUCTOR POWER 3.3UH 4.0A SMD 0.197" L x 0.197" W x 0.177" H (5.00mm x 5.00mm x 4.50mm); PARTNO: LQW18AN22NJ00D
L11 = MyPassives:INDUCTOR: Standard SMD inductor; PARTNO: LQW18AN56NG00D
L12 = MyPassives:INDUCTOR: Standard SMD inductor; PARTNO: MLZ2012M4R7WT000
L14-L16 L21 L22 = SparkFun-Passives:INDUCTOR: Inductors Basic Inductor/Choke - 0603 and 1206. Footprints are not proven and vary greatly between part numbers. INDUCTOR POWER 3.3UH 4.0A SMD 0.197" L x 0.197" W x 0.177" H (5.00mm x 5.00mm x 4.50mm)
L17 = MyPassives:INDUCTOR: Standard SMD inductor; PARTNO: HK1608R47J-T
R1 = SparkFun-Passives:RESISTOR: Resistor Basic schematic elements and footprints for 0603, 1206, and PTH resistors.; PARTNO: RC0603JR-0751KL
R2 = SparkFun-Passives:RESISTOR: Resistor Basic schematic elements and footprints for 0603, 1206, and PTH resistors.; PARTNO: RC0603FR-1016KL
R3 = SparkFun-Passives:RESISTOR: Resistor Basic schematic elements and footprints for 0603, 1206, and PTH resistors.; PARTNO: RC0603JR-071K2L
R4 = SparkFun-Passives:RESISTOR: Resistor Basic schematic elements and footprints for 0603, 1206, and PTH resistors.; PARTNO: RC0603JR-071K1L
R5 R6 R9 R10 R12 R14-R16 R23 = SparkFun-Passives:RESISTOR: Resistor Basic schematic elements and footprints for 0603, 1206, and PTH resistors.; PARTNO: RC0603JR-0710KL
R11 = SparkFun-Passives:RESISTOR: Resistor Basic schematic elements and footprints for 0603, 1206, and PTH resistors.; PARTNO: RC0603JR-073KL
R19 = SparkFun-Passives:RESISTOR: Resistor Basic schematic elements and footprints for 0603, 1206, and PTH resistors.
R22 = SparkFun-Passives:RESISTOR: Resistor Basic schematic elements and footprints for 0603, 1206, and PTH resistors.; PARTNO: RC0603JR-0722RL
S1 = c&k-switch:KMR221NGLFS: Miniature tactile switch, 4-lead SMD; PARTNO: KMR221NGLFS
TP1-TP9 = testpad:TP: Test pad
U1 = diodesinc:AP3211; PARTNO: AP3211KTR-G1
U3 = st-power:LDF: Low Noise Adjustable LDO (1A max); PARTNO: LDFPUR
U4 = diodesinc:DMN63D8LDW: Dual N-Channel MOSFET
U5 = SparkFun-PowerIC:V_REG_LDO: Voltage Regulator LDO Standard 150mA LDO voltage regulator in SOT-23 layout. Micrel part MIC5205. BP (by-pass) pin is used to lower output noise with 470pF cap.; PARTNO: LP5907QMFX-1.8Q1
U6 = eeprom:24LC01B: 1KB I2C EEPROM; PARTNO: 24LC01BT-I/OT
U7 = nxp:AFT0SMS003N; PARTNO: AFT05MS003NT1
U8 = telit:SE873: Telit SE873 GNSS Receiver; PARTNO: SE873Q5
U9 = diodesinc:DMN63D8LDW: Dual N-Channel MOSFET; PARTNO: DMN63D8LDW
U10 = johanson-technology:1575AT43A0040E: SMD Ceramic GNSS Antenna; PARTNO: 1575AT43A0040E
U11 U12 = EZRadioPRO:SI4463; PARTNO: SI4463-C2A-GMR
U13 = stm32:STM32L432KXXX; PARTNO: STM32L431KBU6
U15 = skyworks:SKYWORKS-13330397LF: SP2T RF Switch; PARTNO: SKY13330-397LF
X1 X2 = adafruit:XTAL-4: Classic 4-pin 3.2 x 2.5mm crystal; PARTNO: CX3225SB30000D0FPLCC

## Board
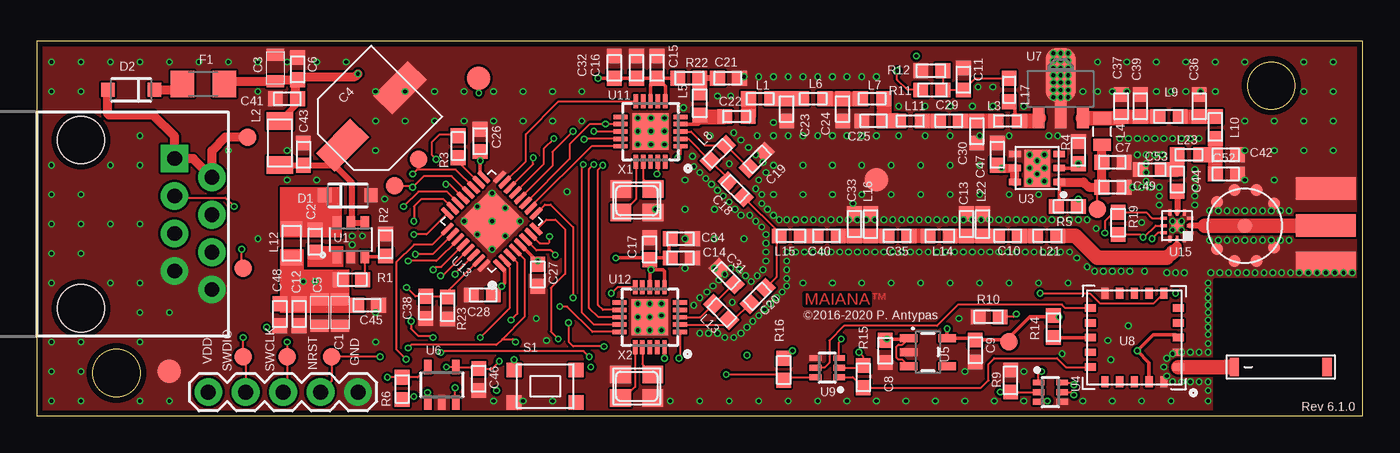
[diagram p7: board, top side]
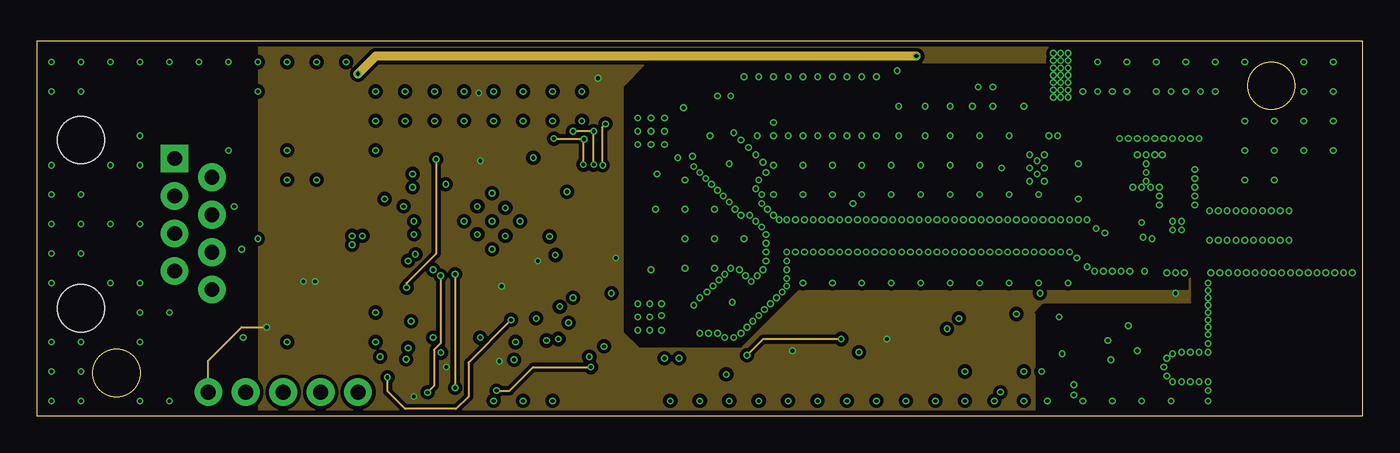
[diagram p8: board, inner layer Layer2]
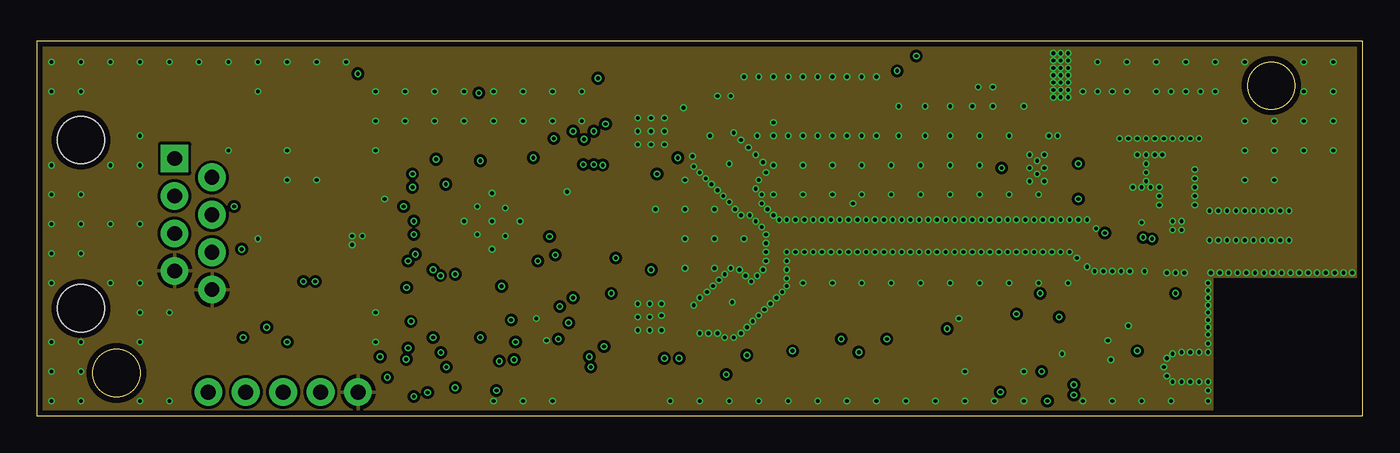
[diagram p9: board, inner layer Layer3]
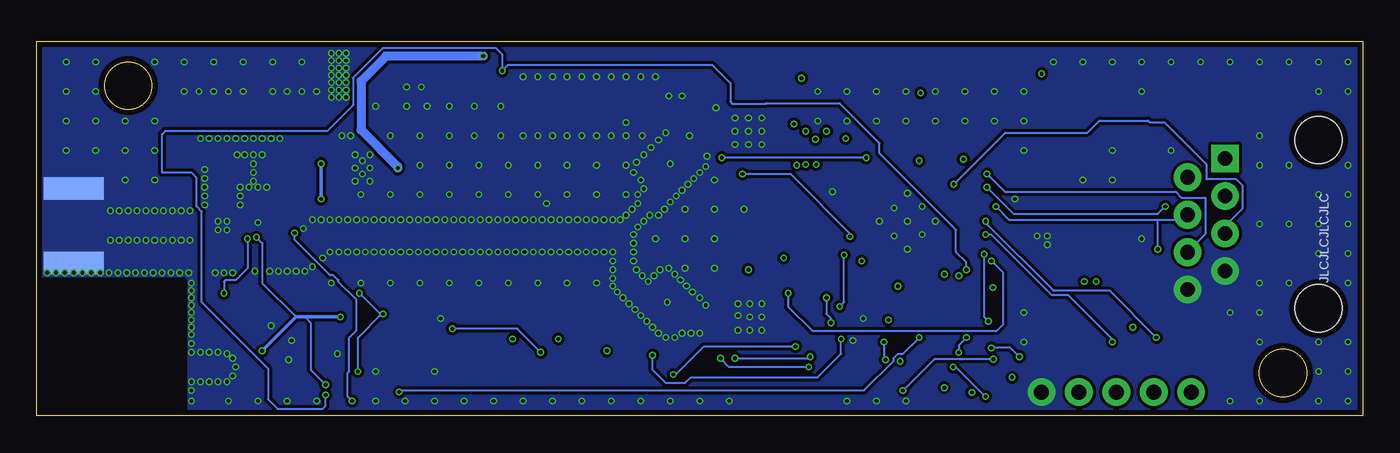
[diagram p10: board, bottom side, seen from below]

Size 90 x 25.4 mm. Coordinates in mm from the lower left corner, seen from the top.
Outline: 0,0 90,0 90,25.4 0,25.4 0,0
Outline: circle at 83.8,22.4 radius 1.6
Outline: circle at 5.4,2.9 radius 1.6
Copper layers (1+2*15+16): Top 0.035mm / dielectric 0.17mm / Layer2 0.018mm / dielectric 1.2mm / Layer3 0.018mm / dielectric 0.17mm / Bottom 0.035mm
Design rules "default *": minimum track width 5mil, minimum drill 10mil, track to track 6mil, track to pad 6mil, pad to pad 6mil, via to via 6mil, smd to smd 0mil, copper to edge 15mil, drill to drill 6mil, minimum pad ring 4mil, minimum via ring 4mil, stop-mask expansion 0mil, vias tented up to drill 20mil, thermal gap 10mil
tRestrict: area 80,0 to 90.2,9.2
bRestrict: area 80,0 to 90.2,9.2

### Footprints (pad centres in the part's own frame; a part is rotated, then mirrored left to right if it is on the bottom)
TP12R = smd 1.2 x 1.2: TP 0,0
TP16R = smd 1.6 x 1.6: TP 0,0
0805 = smd 0.8 x 1.2: 1 -0.9,0; 2 0.9,0
0603-CAP = smd 1 x 1: 1 -0.7,0; 2 0.8,0
PCAP_6.3X5.4-ELECT = smd 3.302 x 1.803: 1 -2.756,0; 2 2.756,0
0603 = smd 1 x 1: P$1 -0.8,0; P$2 0.8,0
SOD-123 = smd 0.9 x 0.95: A 1.575,0; C -1.575,0
R1206 = smd 1.6 x 1.803: 1 -1.422,0; 2 1.422,0
SMA-EDGE = smd 1.524 x 4.064: GND@0 0,0; GND@1 5.08,0; SIG 2.54,0 | smd 1.524 x 4.064 bottom: GND@2 0,0; GND@3 5.08,0
1X05 = drill 1.016 pad 1.88: 1 0,0; 2 2.54,0; 3 5.08,0; 4 7.62,0; 5 10.16,0
RJ45-8 = drill 1 pad 1.88 square: 1 -4.445,6.35 | drill 1 pad 1.88: 2 -3.175,8.89; 3 -1.905,6.35; 4 -0.635,8.89; 5 0.635,6.35; 6 1.905,8.89; 7 3.175,6.35; 8 4.445,8.89 | hole 3.2: -5.715,0; 5.715,0
1206 = smd 1.2 x 1.8: P$1 -1.5,0; P$2 1.5,0
0603' = smd 1 x 1: 1 -0.7,0; 2 0.8,0
0805' = smd 1 x 1.4: P$1 -1,0; P$2 1,0
0603-RES = smd 1 x 1: 1 -0.7,0; 2 0.8,0
KMR221NGLFS = smd 1 x 1: P$1 -2.1,1.1; P$2 -2.1,-1.1; P$3 2.1,-1.1; P$4 2.1,1.1
TP10R = smd 1 x 1: TP 0,0
TP08R = smd 0.8 x 0.8: TP 0,0
SOT23-6 = smd 0.6 x 0.9: 1 -0.95,-1.15; 2 0,-1.15; 3 0.95,-1.15; 4 0.95,1.15; 5 0,1.15; 6 -0.95,1.15
DFN-6 = smd 0.8 x 0.45: P$1 -1.5,0.95; P$2 -1.5,0; P$3 -1.5,-0.95; P$4 1.5,-0.95; P$5 1.5,0; P$6 1.5,0.95 | smd 1.75 x 2.5: P$7 0,0
SOT363 = smd 0.4 x 0.8: 1 -0.65,-0.8; 2 0,-0.8; 3 0.65,-0.8; 4 0.65,0.8; 5 0,0.8; 6 -0.65,0.8
SOT23-5 = smd 0.55 x 1.2: 1 -0.95,-1.3; 2 0,-1.3; 3 0.95,-1.3; 4 0.95,1.3; 5 -0.95,1.3
SOT23-5' = smd 0.5 x 1: 1 -0.95,-1.2; 2 0,-1.2; 3 0.95,-1.2; 4 0.95,1.2; 5 -0.95,1.2
SOT-89 = smd 0.8 x 1.4: 1 -1.499,-1.981; 3 1.499,-1.981 | smd 0.8 x 1.9: 2 0,-1.727 | smd 2.032 x 3.65: 2@1 0,0.94
SE873 = smd 0.75 x 0.5: P$1 -3,2; P$2 -3,1; P$3 -3,0; P$4 -3,-1; P$5 -3,-2; P$11 3,-2; P$12 3,-1; P$13 3,0; P$14 3,1; P$15 3,2 | smd 0.5 x 0.75: P$6 -2,-3; P$7 -1,-3; P$8 0,-3; P$9 1,-3; P$10 2,-3; P$16 2,3; P$17 1,3; P$18 0,3; P$19 -1,3; P$20 -2,3
1575AT43A0040E = smd 0.635 x 1.27: P$1 -3.2,0; P$2 3.1,0
SI4463 = smd 0.95 x 0.3: 1 -2.05,1; 2 -2.05,0.5; 3 -2.05,0; 4 -2.05,-0.5; 5 -2.05,-1; 11 2.05,-1; 12 2.05,-0.5; 13 2.05,0; 14 2.05,0.5; 15 2.05,1 | smd 0.3 x 0.95: 6 -1,-2.05; 7 -0.5,-2.05; 8 0,-2.05; 9 0.5,-2.05; 10 1,-2.05; 16 1,2.05; 17 0.5,2.05; 18 0,2.05; 19 -0.5,2.05; 20 -1,2.05 | smd 2.45 x 2.45: EXP 0,0
QFN32 = smd 1 x 0.3: 1 -2.5,1.75; 2 -2.5,1.25; 3 -2.5,0.75; 4 -2.5,0.25; 5 -2.5,-0.25; 6 -2.5,-0.75; 7 -2.5,-1.25; 8 -2.5,-1.75; 17 2.5,-1.75; 18 2.5,-1.25; 19 2.5,-0.75; 20 2.5,-0.25; 21 2.5,0.25; 22 2.5,0.75; 23 2.5,1.25; 24 2.5,1.75 | smd 0.3 x 1: 9 -1.75,-2.5; 10 -1.25,-2.5; 11 -0.75,-2.5; 12 -0.25,-2.5; 13 0.25,-2.5; 14 0.75,-2.5; 15 1.25,-2.5; 16 1.75,-2.5; 25 1.75,2.5; 26 1.25,2.5; 27 0.75,2.5; 28 0.25,2.5; 29 -0.25,2.5; 30 -0.75,2.5; 31 -1.25,2.5; 32 -1.75,2.5 | smd 3.2 x 3.2: EXP 0,0
QFN12 = smd 0.44 x 0.2: P$1 -0.9,0.5; P$2 -0.9,0; P$3 -0.9,-0.5; P$7 0.9,-0.5; P$8 0.9,0; P$9 0.9,0.5 | smd 0.2 x 0.44: P$4 -0.5,-0.9; P$5 0,-0.9; P$6 0.5,-0.9; P$10 0.5,0.9; P$11 0,0.9; P$12 -0.5,0.9 | smd 0.76 x 0.76: P$13 0,0
NX3225 = smd 1.4 x 1.2: 1 -1.1,-0.8; 2 1.1,-0.8; 3 1.1,0.8; 4 -1.1,0.8

### Placement (x,y rotation side)
1V8  66,5 0 top
3V3  30,22.9 0 top
C1  20.59,7 270 top
C2  18.9,11.8 90 top
C3  16.2,23.6 90 top
C4  22.7,20.3 45 top
C5  19.2,7 270 top
C6  17.7,23.5 90 top
C7  73,17.2 0 top
C8  57.59,4.41 270 top
C9  63.7,4.44 270 top
C10  65.9,12.2 0 top
C11  62.9,22.8 90 top
C12  17.8,6.9 270 top
C13  63.1,13 270 top
C14  43.7,10.7 0 top
C15  42.1,23.6 90 top
C16  40.7,23.6 90 top
C17  41.6,11.28 90 top
C18  47.4,15.4 315 top
C19  48.9,17.4 225 top
C20  48.9,8.1 45 top
C21  46.9,22.9 0 top
C22  47.5,20.3 0 top
C23  50.9,20.8 270 top
C24  54.7,20.8 270 top
C25  56.8,20 180 top
C26  30.09,18.63 90 top
C27  34.01,9.58 270 top
C28  30.29,8.19 180 top
C29  61.9,20 0 top
C30  63.8,19.3 270 top
C31  46.8,9.5 315 top
C32  39.2,23.6 90 top
C33  55.5,13 270 top
C34  43.7,12 0 top
C35  58.4,12.2 0 top
C36  78.9,21 90 top
C37  73.6,21 90 top
C38  26.4,7.4 270 top
C39  74.9,21 90 top
C40  53.6,12.2 0 top
C41  17,21.5 180 top
C42  80.7,17.7 0 top
C43  18.1,17.7 90 top
C44  77.41,16.03 270 top
C45  22.4,7.5 0 top
C46  30,2.5 270 top
C47  65.2,17.7 90 top
C48  16.5,6.9 270 top
C49  73,15.5 0 top
C52  80.7,16.4 0 top
C53  75.7,16.7 180 top
D1  21.12,14.95 0 top
D2  6.4,22.1 180 top
F1  11.3,22.5 0 top
GND1  57,16 0 top
GND2  9,3 0 top
J$1  87.5,10.35 90 top
JLINK  21.8,1.6 180 top
JP1  3,13 270 top
L1  49.1,21.5 0 top
L2  16.5,18.5 90 top
L3  65.9,20 0 top
L4  72.31,19.29 90 top
L5  470nH  [0603']  45,21.2 270 top
L6  52.7,21.5 0 top
L7  56.7,21.5 0 top
L8  200nH  [0603']  46.2,17.8 45 top
L9  18nH  [0603']  76.8,20.3 0 top
L10  22nH  [0603']  80,19.6 270 top
L11  59.3,20 0 top
L12  4.7uH  [0805']  17.3,11.7 270 top
L13  200nH  [0603']  46.5,7 135 top
L14  330nH  [0603']  61.3,12.2 180 top
L15  100nH  [0603']  51.2,12.2 180 top
L16  10nH  [0603']  56.6,13 270 top
L17  66,22.1 90 top
L21  100nH  [0603']  68.6,12.2 180 top
L22  10nH  [0603']  64.2,13 270 top
L23  78.2,17.7 180 top
NRST  20,4 0 top
R1  21.42,9.23 180 top
R2  23.67,11.63 270 top
R3  28.6,18.3 270 top
R4  70.7,17.9 270 top
R5  70,14.2 180 top
R6  24.8,1.8 90 top
R9  66.1,2.4 270 top
R10  64.6,6.7 0 top
R11  60.8,22.1 180 top
R12  60.7,23.4 0 top
R14  69,6 90 top
R15  56.1,2.6 90 top
R16  50.7,3.1 90 top
R19  73.4,13.1 270 top
R22  44.3,22.9 180 top
R23  27.89,7.36 270 top
RX  24.3,15.6 0 top
S1  34.5,2 0 top
SWCLK  17,4 0 top
SWDIO  14,4 0 top
TP1  82,12.9 0 top
TP2  81.3,15.3 0 top
TP3  81.3,10.5 0 top
TP4  82.8,15.3 0 top
TP5  84,14.4 0 top
TP6  80.1,11.3 0 top
TP7  82.8,10.5 0 top
TP8  80.1,14.5 0 top
TP9  84,11.4 0 top
TX  25.9,17.4 0 top
TX_OFF  14,10 0 top
U1  21.32,11.94 0 top
U3  67.9,16.8 180 top
U4  68.8,1.6 270 top
U5  60.49,4.31 270 top
U6  24LC01B  [SOT23-5']  27.5,2.1 0 top
U7  69.5,22.18 0 top
U8  74.5,5.3 180 top
U9  53.66,3.26 90 top
U10  84.49,3.3 0 top
U11  41.66,19.28 180 top
U12  41.61,6.68 180 top
U13  30.88,13.19 135 top
U15  77.4,12.9 180 top
V_IN  14.3,18.9 0 top
V_PA  72,14 0 top
X1  40.73,14.59 0 top
X2  40.72,1.99 0 top

### Tracks (layer width: path | path; a pad name or v marks a point on that pad's centre or on a via)
1V8  (via drill 0.25)
  Top 0.152: U9.2 55.96,3.26 R15.2 56.1,4 v55.8,4.3 | R19.2 74.89,12.3 v75.09,12.1 75.15,12.1 75.95,12.9 U15.P$8 | U4.6 70.25,2.25 v70.4,2.1 | 1V8.TP 65.85,5.15
  Top 0.254: U8.P$3 77.3,5.5 75.8,5.5 v74.7,4.4 75.5,3.6 U8.P$19 | v69.4,6.7 69.3,6.8 R14.2 68.9,6.7 67.4,6.7 65.85,5.15 65.84,5.14 C9.1 63.58,5.26 U5.5 v61.79,5.9
  Bottom 0.152: v55.8,4.3 57.4,5.9 v61.79,5.9 | 71.8,6.7 71.4,6.3 71.4,3.1 v70.4,2.1 | v75.09,12.1 74.69,11.7 74.69,8.99 72.4,6.7
  Bottom 0.254: v69.4,6.7 71.8,6.7 72.4,6.7 v74.7,4.4
3.3V  (via drill 0.25)
  Top 0.152: v57.7,5.2 57.61,5.11 C8.1 | v31.4,3.7 30.9,3.2 C46.1 29.9,3.3 U6.4 v27.8,3.3 | R6.1 25,1.3 v25.6,1.3 | U5.3 58.74,3.81 58.49,3.81 58.36,3.94 58.36,4.68 58.49,4.81 58.74,4.81 U5.1 | U15.P$9 76.1,12.4 v75.7,12 | R1.2 19.27,9.23 19.2,9.3 | 3V3.TP v30,21.9
  Top 0.254: R16.2 51.2,4.4 v51.3,4.4 | U13.17 30.1,16.45 v30.1,17.3 30.1,17.48 C26.1 | U13.5 34.01,10.41 C27.1 v34,10.5 | U13.1 31.75,9.85 31.75,8.98 v31.55,8.78 31.55,8.75 C28.1 | U5.1 59.13,5.2 v57.7,5.2 | 18.1,9.3 17.2,9.3 17.3,9.4 | 18.1,9.3 19.2,9.3 | R1.2 20.59,9.2 C1.1 | C48.1 C12.1 18.9,7.6 C5.1 C1.1 | v18.1,9.1 18.1,9.3 | C1.1 21.3,7.9 C45.1 | C15.1 C16.1 C32.1 v38.1,22.9 | C15.1 R22.2 | C15.1 41.66,22.46 U11.8 | U11.6 42.66,22.34 C15.1 | U12.8 41.61,9.81 v41.7,9.9 | U12.6 42.61,9.79 42.5,9.9 v41.7,9.9 | 41.69,10.69 41.7,10.68 v41.7,9.9 | C14.1 42.9,10.7 | 42.9,10.7 41.7,10.7 41.69,10.69 | 41.69,10.69 C17.1 41.48,10.7 v39.3,10.7 | C34.1 42.9,11.9 42.9,10.7
  Top 0.61: L12.P$2 17.3,9.4
  Layer2 0.152: JLINK.5 11.64,3.74 13.9,6 v15.6,6
  Bottom 0.152: v25.6,1.3 27.6,3.3 v27.8,3.3 | v75.7,12 75.7,10 76.5,9.2 77.2,9.2 77.3,9.1 v77.3,8.3
  other vias: 18.9,9.1
  pour Layer2 (isolate 0.25): 15.1,28.9 78.4,28.9 78.25,7.66 68.26,7.66 67.61,7 67.7,6.91 67.7,-4.2 15.1,-4.44
  cutout Layer2: 39.9,22.3 39.9,5.7 40.9,4.7 47.8,4.7 51.7,8.6 78.12,8.6 78.12,23.8 41.4,23.8
!EEPROM_WRITE_EN  (via drill 0.25)
  Top 0.152: U6.5 25.85,2.6 R6.2 v23.8,2.6 | U13.3 32.6,10.41 32.6,6.9 v32.2,6.5
  Layer2 0.152: v32.2,6.5 29.3,3.6 29.3,1.3 28.46,0.46 25,0.46 23.8,1.66 v23.8,2.6
BOOT0  (via drill 0.25)
  Top 0.152: U13.31 27.89,8.43 27.89,8.1 | 27.89,8.1 R23.1 | R3.1 28.54,19.06 27.31,19.06 26.8,18.55 26.8,17.7 v27.1,17.4 | v25.1,8.7 25.7,8.1 C38.1 27.89,8.1
  Layer2 0.152: v27.1,17.4 27.1,11 25.1,9 v25.1,8.7
BOOT_CTRL
  Top 0.152: U13.18 28.6,17.24 R3.2
CS1
  Top 0.152: U11.15 37.64,18.28 33.53,14.17 U13.10
CS2  (via drill 0.25)
  Top 0.152: U12.15 37.72,5.68 36,7.4 v35.5,7.4 | v35.2,10.9 34.89,11.21 33.92,11.21 U13.6
  Bottom 0.152: v35.2,10.9 35.2,7.7 v35.5,7.4
GND  (via drill 0.25)
  other vias: 77.9,9.7 77.3,9.7 68.3,11.1 64.7,11.1 64.1,11.1 63.5,11.1 62.9,11.1 62.3,11.1 61.7,11.1 61.1,11.1 60.5,11.1 59.9,11.1 64.1,13.3 63.5,13.3 62.9,13.3 62.3,13.3 69.5,21.6 69.5,22.1 69.5,22.6 69.5,23.1 69.5,23.6 69.5,24.1 69.5,24.6 70,21.6 70,22.1 70,22.6 70,23.1 70,23.6 70,24.1 70,24.6 69,24.6 69,24.1 69,23.6 69,23.1 69,22.6 69,22.1 69,21.6 79.5,1.7 71,1 31,1 56,17 54,17 52,17 56,15 58,15 62,15 64,15 30.9,13.2 31.8,12.2 29.9,14.2 29,13.2 30.9,15.1 30.9,11.3 32.8,13.2 29.9,12.3 31.8,14.1 41.6,6.7 41.6,5.8 41.6,7.6 42.4,7.6 42.4,6.8 42.4,5.8 40.8,5.8 40.8,6.7 40.8,7.6 41.7,19.3 41.7,18.4 41.7,20.2 42.6,20.2 42.6,19.3 42.6,18.4 40.8,18.4 40.8,19.3 40.8,20.2 64.7,13.3 44,12 44,14 42,14 44,16 49,1 47,1 45,1 43,1 23,18 49,23 51,23 74.1,6.1 72.7,5.1 79.5,7 79.5,9 79.5,8 79.5,6 79.5,4.9 82.1,9.7 82.7,9.7 83.3,9.7 85.1,9.7 85.7,9.7 86.3,9.7 86.9,9.7 87.5,9.7 88.1,9.7 88.7,9.7 81.5,9.7 79.5,8.5 79.5,7.5 79.5,6.5 79.5,5.5 79.5,2.3 77.1,4.2 77.7,4.3 78.3,4.3 78.9,4.3 79.5,4.3 78.9,2.3 78.3,2.3 77.7,2.3 76.7,2.7 76.7,3.9 76.5,3.3 83.9,9.7 84.5,9.7 79.5,1 34.6,5.1 72.9,3.8 61.7,13.3 69.6,4.2 68.3,13.3 33,1 35,1 35,20 37,20 31,22 29,22 29,20 44,10 21.4,11.6 21.4,12.2 22.1,12.2 23.6,14.7 1,1 3,1 3,3 1,3 1,11 1,13 1,17 1,24 13,24 1,22 50,17 50,15 52,15 61.1,13.3 60.5,13.3 59.9,13.3 47.8,18.7 47.3,19.2 47.1,21.7 46.2,21.7 43.9,20.9 59.3,13.3 58.1,13.3 57.5,13.3 56.9,13.3 56.3,13.3 58.7,13.3 55.7,13.3 55.1,13.3 54.5,13.3 53.9,13.3 59.3,11.1 58.1,11.1 57.5,11.1 56.9,11.1 56.3,11.1 58.7,11.1 55.7,11.1 55.1,11.1 54.5,11.1 53.9,11.1 53.3,13.3 52.7,13.3 52.1,13.3 51.5,13.3 50.9,13.3 53.3,11.1 52.7,11.1 52.1,11.1 51.5,11.1 50.9,11.1 50.6,8.4 50.2,8 49.8,7.6 49.4,7.2 49,6.8 48.6,6.4 48.2,6 47.8,5.6 47.3,5.3 46.7,5.3 46.2,5.6 45.6,5.6 45,5.6 49.6,14 49.2,14.4 49.2,15 48.8,15.4 47,17.1 49,16 49.5,16.5 48.4,13.6 48.8,13.2 49.2,12.8 49.3,9.9 48.9,9.5 48.5,9.1 47.2,7.7 47.8,13.6 47.4,14 47,14.5 46.6,14.9 46.2,15.3 45.8,15.7 45.4,16.1 45,16.5 44.6,16.9 44.5,17.6 48.1,9.5 47.7,9.9 47.1,10 46.7,9.6 46.3,9.2 45.9,8.8 45.5,8.4 45,8 44.6,7.5 46,14 46,12 46,10 48,12 54,15 55.4,14.4 17,18 17,16 19,16 23,20 25,20 25,22 23,22 23,5 23,7 27,22 35,22 53,23 55,23 57,23 50,19 52,19 54,19 48.3,18.2 48.8,17.7 49.3,17.2 45.7,19 56,19 55,19 53,19 51,19 50,23 52,23 54,23 56,23 67,21 50,19.9 48.9,19 36,15.2 33.9,6.6 33,22 82,24 80,24 78,24 76,24 74,24 72,24 72,22 74,22 76,22 78,22 80,22 79,22 77,22 73,22 71,22 62,17 62,19 64,17 64,19 66,19 66,15 64.9,21 65.3,13.3 65.9,13.3 66.5,13.3 67.1,13.3 67.7,13.3 65.3,11.1 65.9,11.1 66.5,11.1 67.1,11.1 67.7,11.1 48,23 58.5,19 58.5,21 51,1 53,1 55,1 57,1 59,1 61,1 63,1 65,1 67,1 73,1 75,1 77,1 37,22 68,15 74.4,15.5 76.2,14.9 57,19 58,17 60,17 60.3,19 67.4,15.9 68.4,15.9 67.4,16.8 67.4,17.7 68.4,17.7 68.4,16.8 67.9,16.4 67.9,17.3 73.5,18.8 74.1,18.8 74.7,18.8 75.3,18.8 75.9,18.8 76.5,18.8 77.1,18.8 77.7,18.8 78.3,18.8 78.9,18.8 78.6,16.7 78.6,16.1 76.2,15.5 78.6,15.5 76.2,14.3 78.6,14.9 82,20 82,18 60,15 89.3,9.7 3,24 3,22 1,9 1,15 3,15 3,13 3,11 5,9 7,9 5,13 7,13 5,17 7,17 7,19 7,7 9,7 7,5 7,1 9,1 1,5 3,5 50,13.6 49.5,12.3 49.5,11.7 49.5,11.1 49.5,10.5 50.9,10.5 50.9,9.9 50.9,9.3 50.4,13.3 68.9,13.3 69.5,13.3 70.1,13.3 70.7,13.3 71.3,13.3 71.9,12.7 68.9,11.1 69.5,11.1 70.1,11.1 70.6,10.7 54,9 52,9 56,9 58,9 60,9 62,9 64,9 68,9 70,9 60.3,21 62,21 68.7,19 69.3,19 63.5,21 64.9,22.3 63.9,22.3 66,9 80.9,9.7 80.3,9.7 79.7,9.7 77.1,13.2 77.7,13.2 77.1,12.6 77.7,12.6 77.1,2.3 78.6,14.3 71.3,10.1 71.8,9.8 72.4,9.8 73,9.8 73.6,9.8 74.2,9.8 76.7,9.7 75.2,9.8 79.6,13.9 80.2,13.9 80.8,13.9 81.4,13.9 82,13.9 82.6,13.9 83.2,13.9 83.8,13.9 84.4,13.9 85,13.9 79.6,11.9 80.2,11.9 80.8,11.9 81.4,11.9 82,11.9 82.6,11.9 83.2,11.9 83.8,11.9 84.4,11.9 85,11.9 74.7,17.7 75.3,17.7 75.9,17.7 76.4,17.7 75.6,15.5 75,15.5 75.3,17.1 75.3,16.5 75.3,15.9 86,24 88,24 88,22 86,22 86,20 88,20 88,18 86,18 84,20 84,18 84,16 82,16 75,13.1 33,20 31,20 62.6,6.6 13,18 15,12 27,20 5,24 7,24 9,24 11,24 15,24 17,24 19,24 21,24 15,22 63,3 67,3 50.9,8.8
  pour Top (isolate 0.16, no thermals): -1,26 92.2,26 92.2,-0.9 -1,-0.9
  pour Bottom (isolate 0.2, no thermals): -3,28 93,28 93,-3 -3,-3
  pour Layer3 (isolate 0.2): -1.6,27 91.3,27 91.3,9.4 79.8,9.4 79.8,-2.4 -1.6,-2.4
GNSS_1PPS
  Top 0.152: U9.5 53.46,3.26 53.8,3.6 53.8,5.1 54.8,6.1 61.1,6.1 62.53,7.53 69.59,7.53 69.82,7.3 U8.P$11
GNSS_EN  (via drill 0.25)
  Top 0.152: U13.2 31.76,10.37 32.11,10.03 32.11,7.31 v30.1,5.3 | v65.4,1.6 R9.2 U4.2
  Bottom 0.152: v30.1,5.3 31.24,4.16 31.59,4.16 31.86,3.89 31.86,3.7 33.84,1.72 65.28,1.72 v65.4,1.6
GNSS_EN_1V8  (via drill 0.25)
  Top 0.152: v68.1,8.3 71.49,8.3 72.17,7.62 75.82,7.62 U8.P$6 | v66.5,6.9 66.3,6.7 R10.2 | U4.1 68,2.8 v68.2,3
  Bottom 0.152: v68.1,8.3 66.7,6.9 66.6,6.9 | 66.6,6.9 v66.5,6.9 | v68.2,3 68.2,5.3 66.6,6.9
GNSS_UART_TX
  Top 0.152: U9.1 55.39,2.61 R15.1 64.1,1.9 64.6,2.4 64.6,3.5 65,3.9 69.25,3.9 69.85,3.3 U8.P$15
I2C_SCL  (via drill 0.25)
  Top 0.152: U13.29 27.54,9.5 v27.4,9.5 | U6.1 26.52,0.93 v26.52,1.58
  Layer2 0.152: v27.4,9.5 27.4,4.9 26.96,4.47 26.96,2.02 v26.52,1.58
I2C_SDA  (via drill 0.25)
  Top 0.152: U13.30 28.4,9.65 v28.4,9.6 | U6.3 28.4,0.95 v28.4,1.9
  Layer2 0.152: v28.4,9.6 v28.4,1.9
MCU_GNSS_1PPS  (via drill 0.25)
  Top 0.152: U13.8 33.96,12.66 34.6,13.3 35.2,13.3 35.86,12.64 35.86,9.63 34.9,8.67 34.9,5.7 v35.4,5.2 | v54.6,5.2 54.64,5.16 54.46,4.98 U9.3
  Layer2 0.152: v54.6,5.2 49.3,5.2 v48.2,4.1
  Bottom 0.152: v48.2,4.1 48.2,3.1 47.32,2.22 45.98,2.22 45.6,2.6 37,2.6 35.4,4.2 v35.4,5.2
MCU_GNSS_UART_RX  (via drill 0.25)
  Top 0.152: U13.9 34.48,14.32 34.88,14.32 36.4,12.8 v36.4,8 | v46.8,2.8 50.3,2.8 R16.1 50.91,2.61 U9.6 | v36.1,6.3 36.1,5 36.4,4.7 v38.5,4.7
  Bottom 0.152: v46.8,2.8 46.6,2.8 44.7,4.7 v38.5,4.7 | v36.4,8 36.4,6.9 36.1,6.6 v36.1,6.3
MCU_UART_RX  (via drill 0.25)
  Top 0.152: U13.20 28.16,16.26 26.26,16.26 25.55,15.55 | 25.55,15.55 v25.5,15.5 | v13.4,14.2 12.8,14.8 9.45,14.8 JP1.3 | RX.TP 25.5,15.6 25.55,15.55
  Bottom 0.152: v25.5,15.5 23.7,13.7 13.9,13.7 v13.4,14.2
MCU_UART_TX  (via drill 0.25)
  Top 0.152: U13.19 28.43,16.7 25.8,16.7 v25.5,16.4 25.9,16.8 TX.TP
  Bottom 0.152: v25.5,16.4 24.3,15.2 12.7,15.2 12.3,14.8 10.68,14.8 10.68,12.3 JP1.6
MISO  (via drill 0.25)
  Top 0.152: U11.13 37.82,19.28 v37.8,19.3 | v36.4,19.3 35,17.9 35,16.96 U13.12 | U12.13 38.12,6.68 37.5,7.3 37.5,16.74 v37.8,17.04
  Layer2 0.152: v36.4,19.3 v37.8,19.3 v37.8,17.04
MOSI  (via drill 0.25)
  Top 0.152: U11.14 37.18,18.78 v37.15,18.75 | U13.13 34.4,17.06 34.4,18.1 v35.1,18.8 | U12.14 37.82,6.18 37,7 37,16.94 v37.1,17.04
  Layer2 0.152: v35.1,18.8 37.1,18.8 v37.15,18.75 37.1,18.7 v37.1,17.04
N$2
  Top 0.254: D1.C 20.37,14.12 U1.6 19.39,13.09 C2.2 18.8,12.7 L12.P$1
N$3
  Top 0.127: C19.2 48.3,16.83 L8.2 45.33,18.37 44.42,19.28 U11.3
N$4
  Top 0.254: C2.1 20.06,11.1 U1.1
N$5
  Top 0.152: R1.1 22.27,9.38 U1.3
  Top 0.254: U1.3 23.63,10.79 R2.2
N$6
  Top 0.127: U11.2 44.23,18.78 L8.1 46.91,16.11 C18.1
N$7
  Top 1.016: L6.P$2 C24.1 L7.P$1
N$8
  Top 0.152: R12.2 R11.1 C11.1 63.7,22.9 L17.P$2
N$9
  Top 1: C10.2 L21.2
N$10
  Top 0.508: 80.6,3.3 U10.P$1
  Top 1: U8.P$1 80.6,3.3
N$11
  Top 1.016: L7.P$2 C25.1 L11.P$1
N$12
  Top 1.016: L1.P$2 C23.1 L6.P$1
N$13
  Top 0.254: R14.1 U8.P$13
N$15
  Top 0.152: TP1.TP 82.29,12.89 80.8,12.89
  Top 0.406: 79.3,12.9 U15.P$2
  Top 1: J$1.SIG 80.8,12.89 79.31,12.89 79.3,12.9
N$16
  Top 0.152: X2.1 39.84,1.19 40.61,1.96 U12.16
N$17
  Top 0.152: U12.17 41.11,3.5 X2.3
N$18
  Top 0.152: X1.1 39.75,13.79 40.66,14.7 U11.16
N$19
  Top 0.152: U11.17 41.16,16.06 X1.3
N$20
  Top 0.127: U12.2 46.67,6.18 L13.1 47.3,6.5 C20.1
N$21
  Top 0.127: U12.3 45.05,6.68 L13.2 47.3,8.93 C31.2
N$22
  Top 0.61: F1.1 9.48,22.1 D2.C
N$23
  Top 0.61: L4.2 | 73.59,20.19 C37.1
  Top 1: U7.3 L4.2 | L4.2 73.59,20.19 | C37.1 C39.1 L9.1
N$24
  Top 0.254: U11.4 44.91,19.78 45,19.87 L5.2
  Top 1.016: L5.2 45.1,20.3 C22.P$1
N$26
  Top 0.254: L17.P$1 66.4,20.9 66.4,20 L3.P$2
  Top 1.016: L3.P$2 67.8,20 U7.1
N$27
  Top 0.254: 21.4,13.17 U1.5
  Top 0.406: U1.5 U1.4 | 21.4,13.17 21.4,15.8 20.2,17 20,17 | L2.P$1 C43.1 18.3,17 20,17 | C4.1 20.75,17.75 20,17
N$28
  Top 1: L9.2 C36.1 L10.1
N$29
  Top 1.016: L3.P$1 C30.1 C29.2
N$30
  Top 0.406: C21.1 R22.1 L5.1
N$31
  Top 1.016: L1.P$1 C22.P$2
N$32  (via drill 0.25)
  Top 0.254: R5.1 v70.7,14.7 | U3.P$2 70.4,16.8 R4.2
  Bottom 0.254: R4.2 v70.7,14.7
  other vias: 70.7,17.1
N$36
  Top 1: L14.1 C13.2 L22.2 C10.1
N$37
  Top 1: C40.2 C33.2 L16.2 C35.1
N$38
  Top 1: C40.1 L15.1
N$39
  Top 1: L14.2 C35.2
N$40
  Top 0.254: L23.P$1 79.03,17.73
  Top 1: C42.1 79.97,17.73 79.03,17.73 | C42.1 L10.2 | C42.1 C52.1
N$41
  Top 0.254: C44.1 77.38,16.7 | L23.P$2
  Top 1: 77.38,16.7 C53.1 | L23.P$2 C44.1
NRST  (via drill 0.25)
  Top 0.152: U13.4 33.1,10.62 33.1,6.7 31.6,5.2 | v25.2,4.6 25.4,4.8 31.2,4.8 31.6,5.2 | v23.3,4 NRST.TP 20,2.34 JLINK.2 | 31.6,5.2 32.3,5.2 v32.5,5 | S1.P$1 v32.4,3.8
  Bottom 0.152: v23.3,4 23.9,4.6 v25.2,4.6 | v32.5,5 32.5,3.9 v32.4,3.8
PA_IN
  Top 1.016: L11.P$2 C29.1
PA_OUT
  Top 0.254: U15.P$5
  Top 0.406: C44.2 U15.P$5
RF_IN
  Top 0.254: U15.P$11 77.4,11.5
  Top 0.61: 77.4,11.5 77.1,11.2 77.1,11.1
  Top 1: 77.1,11.1 76.7,10.7 72,10.7 70.5,12.2 L21.1
RX_EN  (via drill 0.25)
  Top 0.152: U15.P$7 75.7,13.4 75.3,13.8 R19.1 73.1,13.8 72.5,13.2 v72.5,12.4 | U4.3 68.55,0.95 v68.6,1
  Bottom 0.152: v68.6,1 68.9,1.3 68.9,2.9 68.8,3 68.8,5.3 68.3,5.8 68.3,7.85 69.54,9.1 69.54,9.19 69.9,9.54 70.09,9.54 72.5,11.95 v72.5,12.4
RX_IC_CLK  (via drill 0.25)
  Top 0.152: U13.26 26.88,10.96 v25.7,10.96 | v27.42,4.28 27.52,4.38 37.12,4.38 v37.5,4 | U12.20 v42.61,3.91 v42.6,3.9 | v25.4,6.4 25.4,5.9 25.9,5.4 26.8,5.4 v26.9,5.3
  Bottom 0.152: v42.6,3.9 37.6,3.9 v37.5,4 | v25.7,10.96 25.7,6.7 v25.4,6.4 | v26.9,5.3 27.42,4.78 v27.42,4.28
RX_IC_DATA  (via drill 0.25)
  Top 0.152: U13.27 27.13,10.5 v25.2,10.5 | U12.10 39.43,8.73 v39,8.3
  Bottom 0.152: v39,8.3 39,7.4 37.36,5.76 24.84,5.76 24.4,6.2 24.4,9.7 v25.2,10.5
RX_IN
  Top 0.127: C18.2 50.4,12.4 L15.2 50.2,12 50.2,9.4 C20.2
SCK  (via drill 0.25)
  Top 0.152: U12.12 38.42,7.18 38.1,7.5 38.1,16.69 v38.41,17 | U13.11 36.18,17.43 36.18,18.43 37.55,19.8 v38.6,19.8 38.62,19.78 U11.12
  Layer2 0.152: v38.41,17 38.41,19.61 v38.6,19.8
SDN1  (via drill 0.25)
  Top 0.152: U13.14 33.7,17.07 v33.7,17.5 | U11.1 43.71,17.71 v43.5,17.5
  Bottom 0.152: v33.7,17.5 v43.5,17.5
SDN2  (via drill 0.25)
  Top 0.152: U13.25 26.82,11.6 25.6,11.6 24.4,10.4 24.4,4.5 v25.07,3.83 | U12.1 43.66,3.96 v43.6,3.9
  Layer2 0.152: v31.2,1.7 32.1,1.7 33.7,3.3 v37.6,3.3
  Bottom 0.152: v37.6,3.3 43,3.3 v43.6,3.9 | v25.07,3.83 27.23,3.83 27.23,3.82 29.08,3.82 v31.2,1.7
SPARE  (via drill 0.25)
  Top 0.152: U13.21 28.02,15.7 v27.76,15.7
  Bottom 0.152: v27.76,15.7 24.26,19.2 18.7,19.2 17.87,20.03 14.57,20.03 14.45,19.9 13.46,19.9 10.62,17.06 10.62,16.07 8.61,16.07 8.18,15.65 8.18,14.03 9.35,12.87 JP1.5
SWCLK  (via drill 0.25)
  Top 0.152: U13.24 26.45,12.3 v25.6,12.3 | v17,5 SWCLK.TP 17,1.88 JLINK.3
  Bottom 0.152: v17,5 17,5.2 20,8.2 21.13,8.2 25.23,12.3 v25.6,12.3
SWDIO  (via drill 0.25)
  Top 0.152: U13.23 27.6,14.7 26.1,14.7 25.6,14.2 v25.6,13.2 | v14,5.3 SWDIO.TP 14.18,3.82 JLINK.4
  Bottom 0.152: v25.6,13.2 25.6,13.1 21,8.5 17.2,8.5 v14,5.3
TRX_IC_CLOCK  (via drill 0.25)
  Top 0.152: U13.7 34.14,11.7 34.74,11.7 34.8,11.76 v34.8,12.16 | U11.19 42.16,16.46 v42.1,16.4
  Bottom 0.152: v42.1,16.4 38.84,16.4 34.8,12.36 v34.8,12.16
TRX_IC_DATA
  Top 0.152: U13.15 33.2,17.28 33.2,19.1 35.43,21.33 U11.10
TX_CTRL  (via drill 0.25)
  Top 0.152: v26.9,9.9 27.1,10.1 27.44,10.1 U13.28 | R11.2 59.1,22.1 58.4,22.8 v58.4,23.4 | U4.5 70.2,1.6 v70.4,1.4
  Top 0.254: U13.28
  Bottom 0.152: v26.9,9.9 26.9,10.4 27.6,11.1 27.6,12.6 32.8,17.8 32.8,18.5 35.5,21.2 40.48,21.2 40.51,21.17 42.8,21.17 42.93,21.3 42.93,22.55 44.18,23.8 58,23.8 v58.4,23.4 58.4,24.5 58.83,24.93 66.52,24.93 68.53,22.92 68.53,21.07 70.3,19.3 81.3,19.3 81.5,19.1 81.5,16.5 79.5,16.5 79.16,16.16 79.16,14.21 78.8,13.85 78.8,7.7 74.3,3.2 74.3,1.1 73.66,0.46 70.6,0.46 70.4,0.66 v70.4,1.4
TX_DISABLE  (via drill 0.25)
  Top 0.152: U13.22 28.58,14.46 27.83,15.21 25.91,15.21 v24.9,14.2 | TX_OFF.TP 14,10.1 13.9,10.2 v13.9,11.3
  Bottom 0.152: v24.9,14.2 24,13.3 13.9,13.3 | JP1.4 12.22,13.3 13.9,13.3 | v13.9,11.3 13.9,13.3
V_BAT  (via drill 0.25)
  Top 0.254: 17.55,21.65 C41.1
  Top 0.406: C41.1 17.7,21.2 L2.P$2
  Top 0.61: U3.P$6 U3.P$5 v65.5,16.8 65.47,16.8 65.44,16.77 C47.1 | v21.8,23.2 21.6,23 17.9,23 C6.1 | F1.2 12.92,22.7 C3.1 16.3,22.8 C6.1 | C6.1 17.55,22.65 17.55,21.65
  Layer2 0.61: v21.8,23.2 23,24.4 v59.7,24.4
  Bottom 0.61: v65.5,16.8 65.5,16.9 68,19.4 68,22.7 66.3,24.4 v59.7,24.4
V_IN
  Top 0.61: V_IN.TP 12.8,18.9 11.89,17.99 JP1.2 10.62,17.45 JP1.1 9.35,18.95 7.9,20.4 4.9,20.4 4.83,20.48 D2.A
V_PA
  Top 0.152: V_PA.TP 72,15.2 C49.1
  Top 0.254: R5.2 69.4,14.4 U3.P$1
  Top 0.61: L4.1 72.4,18.3 72.3,18.2 C7.1 C49.1 71.4,15.5 71.05,15.85 U3.P$1
(copper drawn outside any net)
  shapes: Top area x5

### Text on the board
Top: MAIANA™
tPlace: Rev 6.1.0
tNames: ©2016-2020 P. Antypas | VDD | GND
bNames: JLCJLCJLCJLC